# EasyEDA Pro project rp2350B（maybe support bf25.12）（only sch）.epro

# Schematic Schematic1

## Sheets
1 RP2350B: Board Name: Board1; Create Date: 2025-10-30; Page Name: RP2350B; Project Name: 飞控; Schematic Name: Schematic1; Update Date: 2025-11-05; Company: 嘉立创EDA; Page Size: A4; Version: V1.0
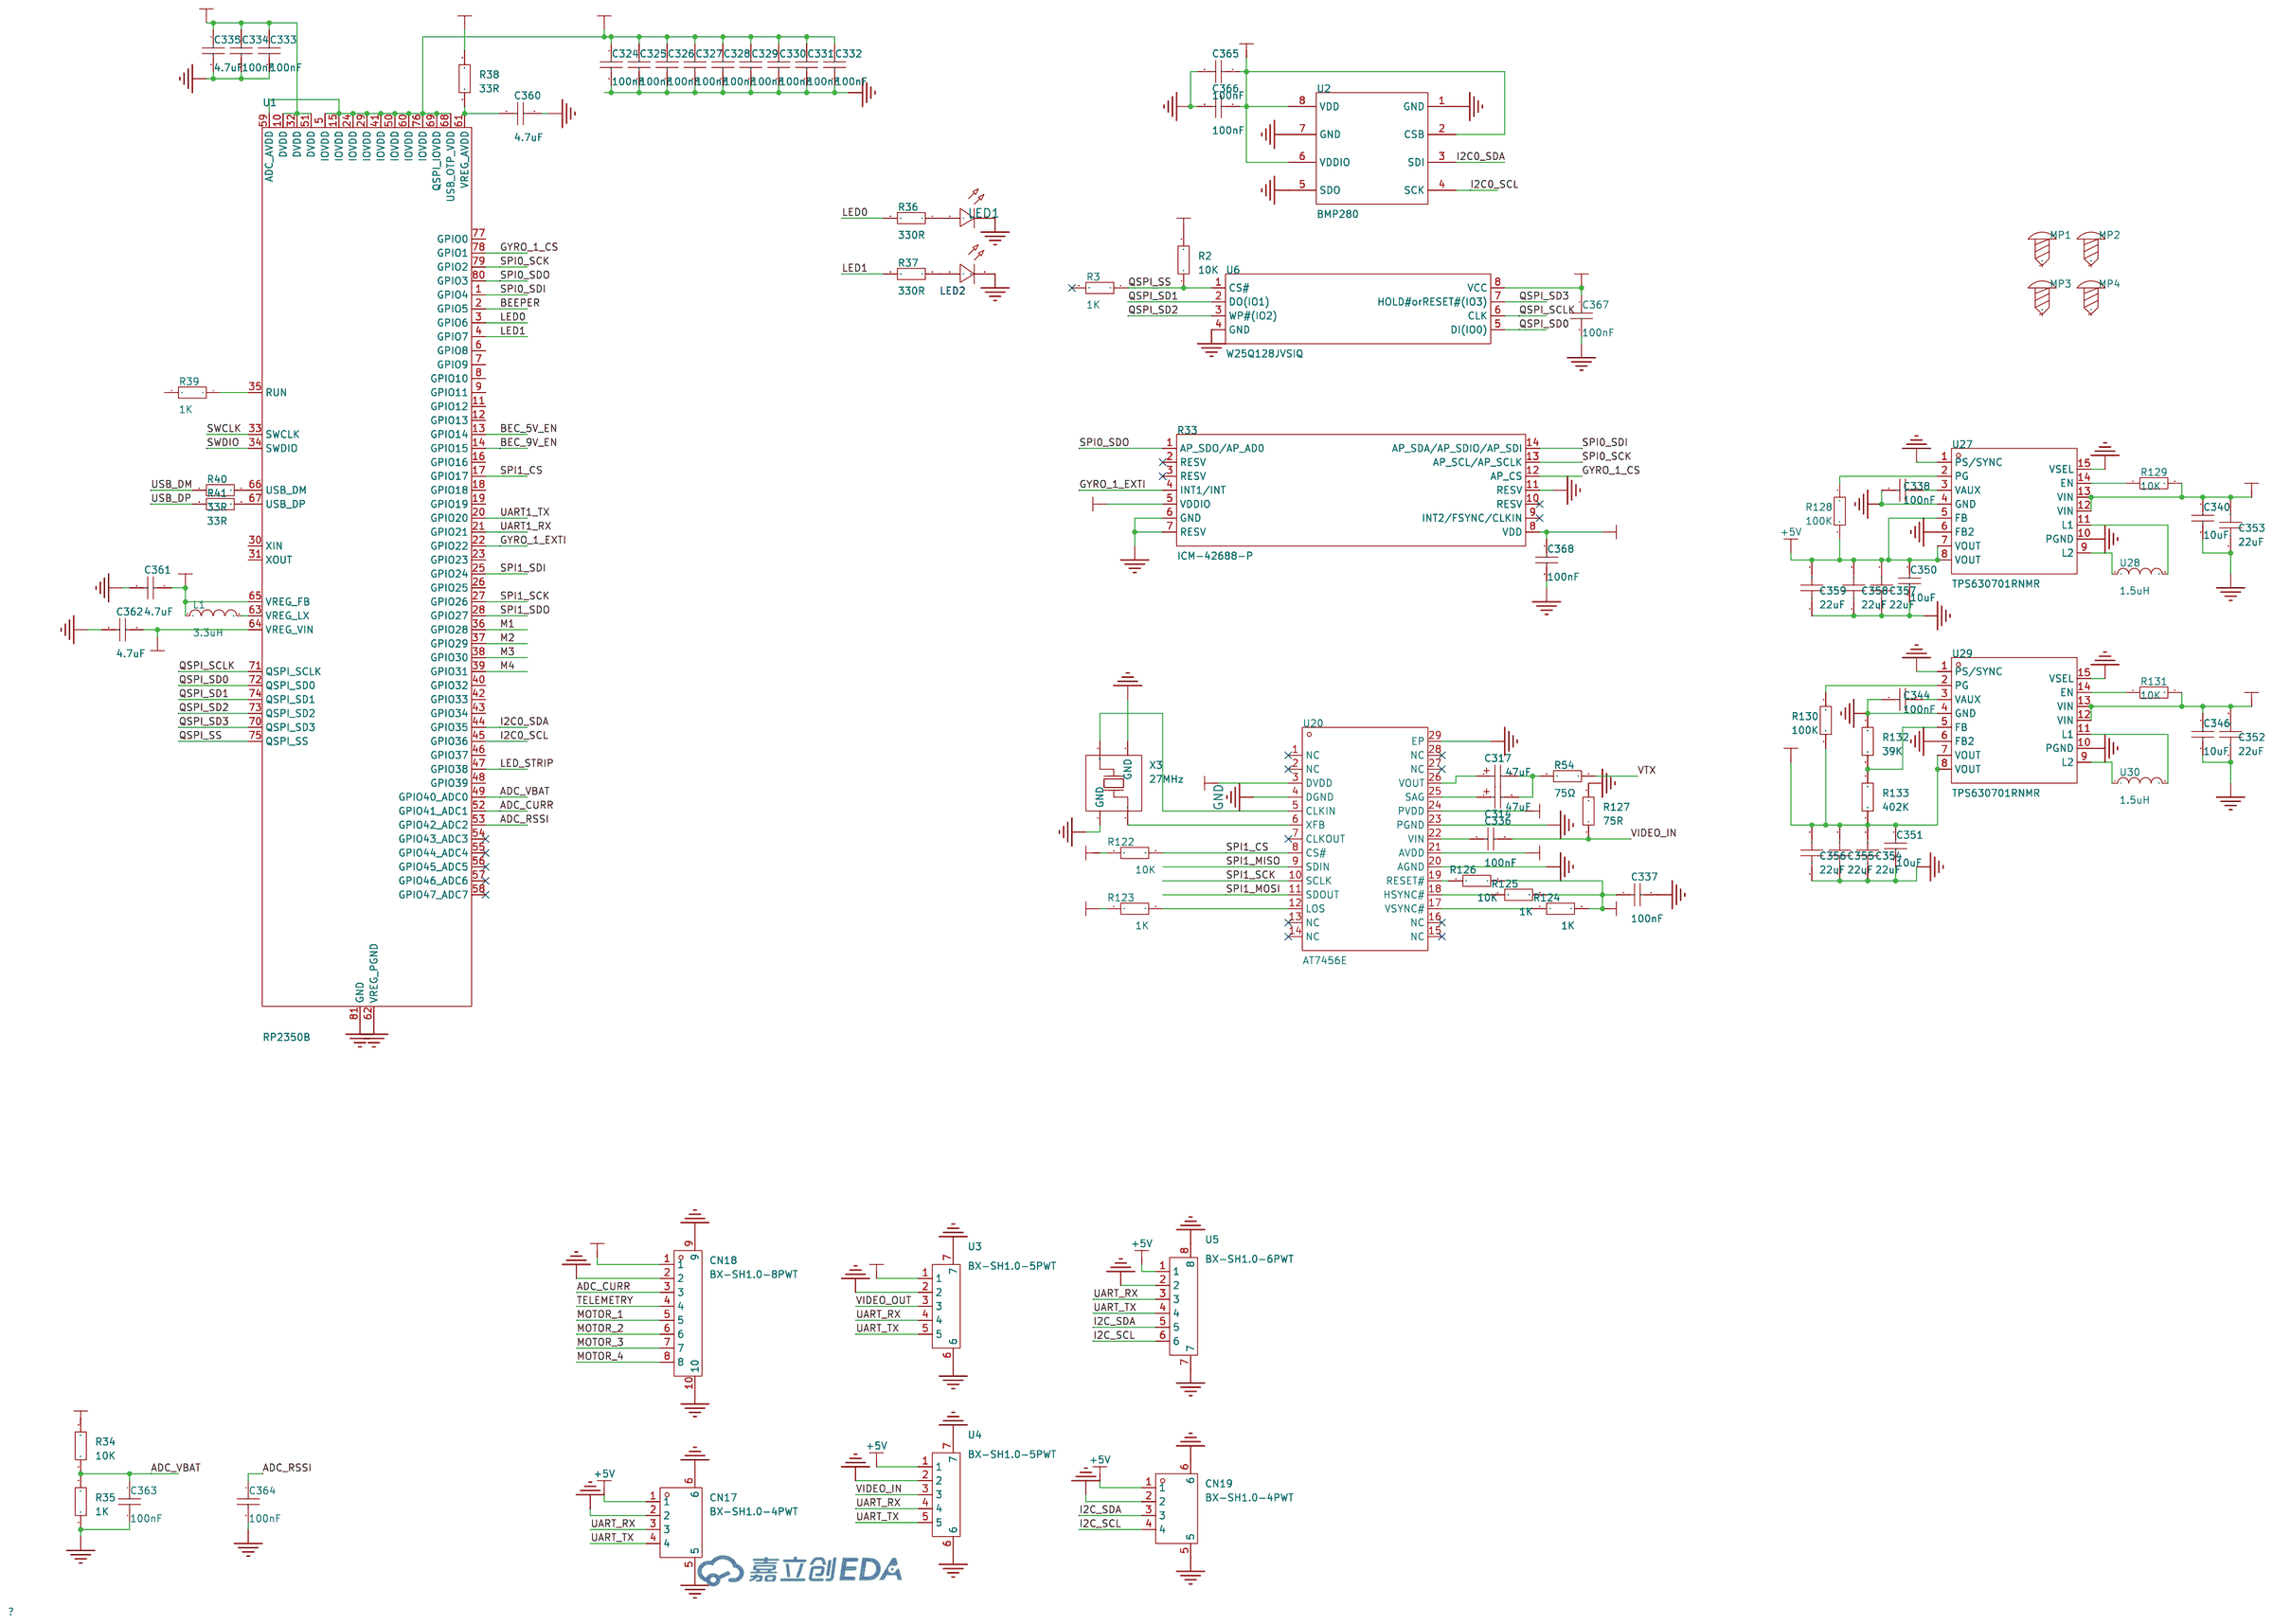
[diagram p0: RP2350B]
2 ELRS: Create Date: 2025-11-03; Page Name: ELRS; Update Date: 2025-11-03
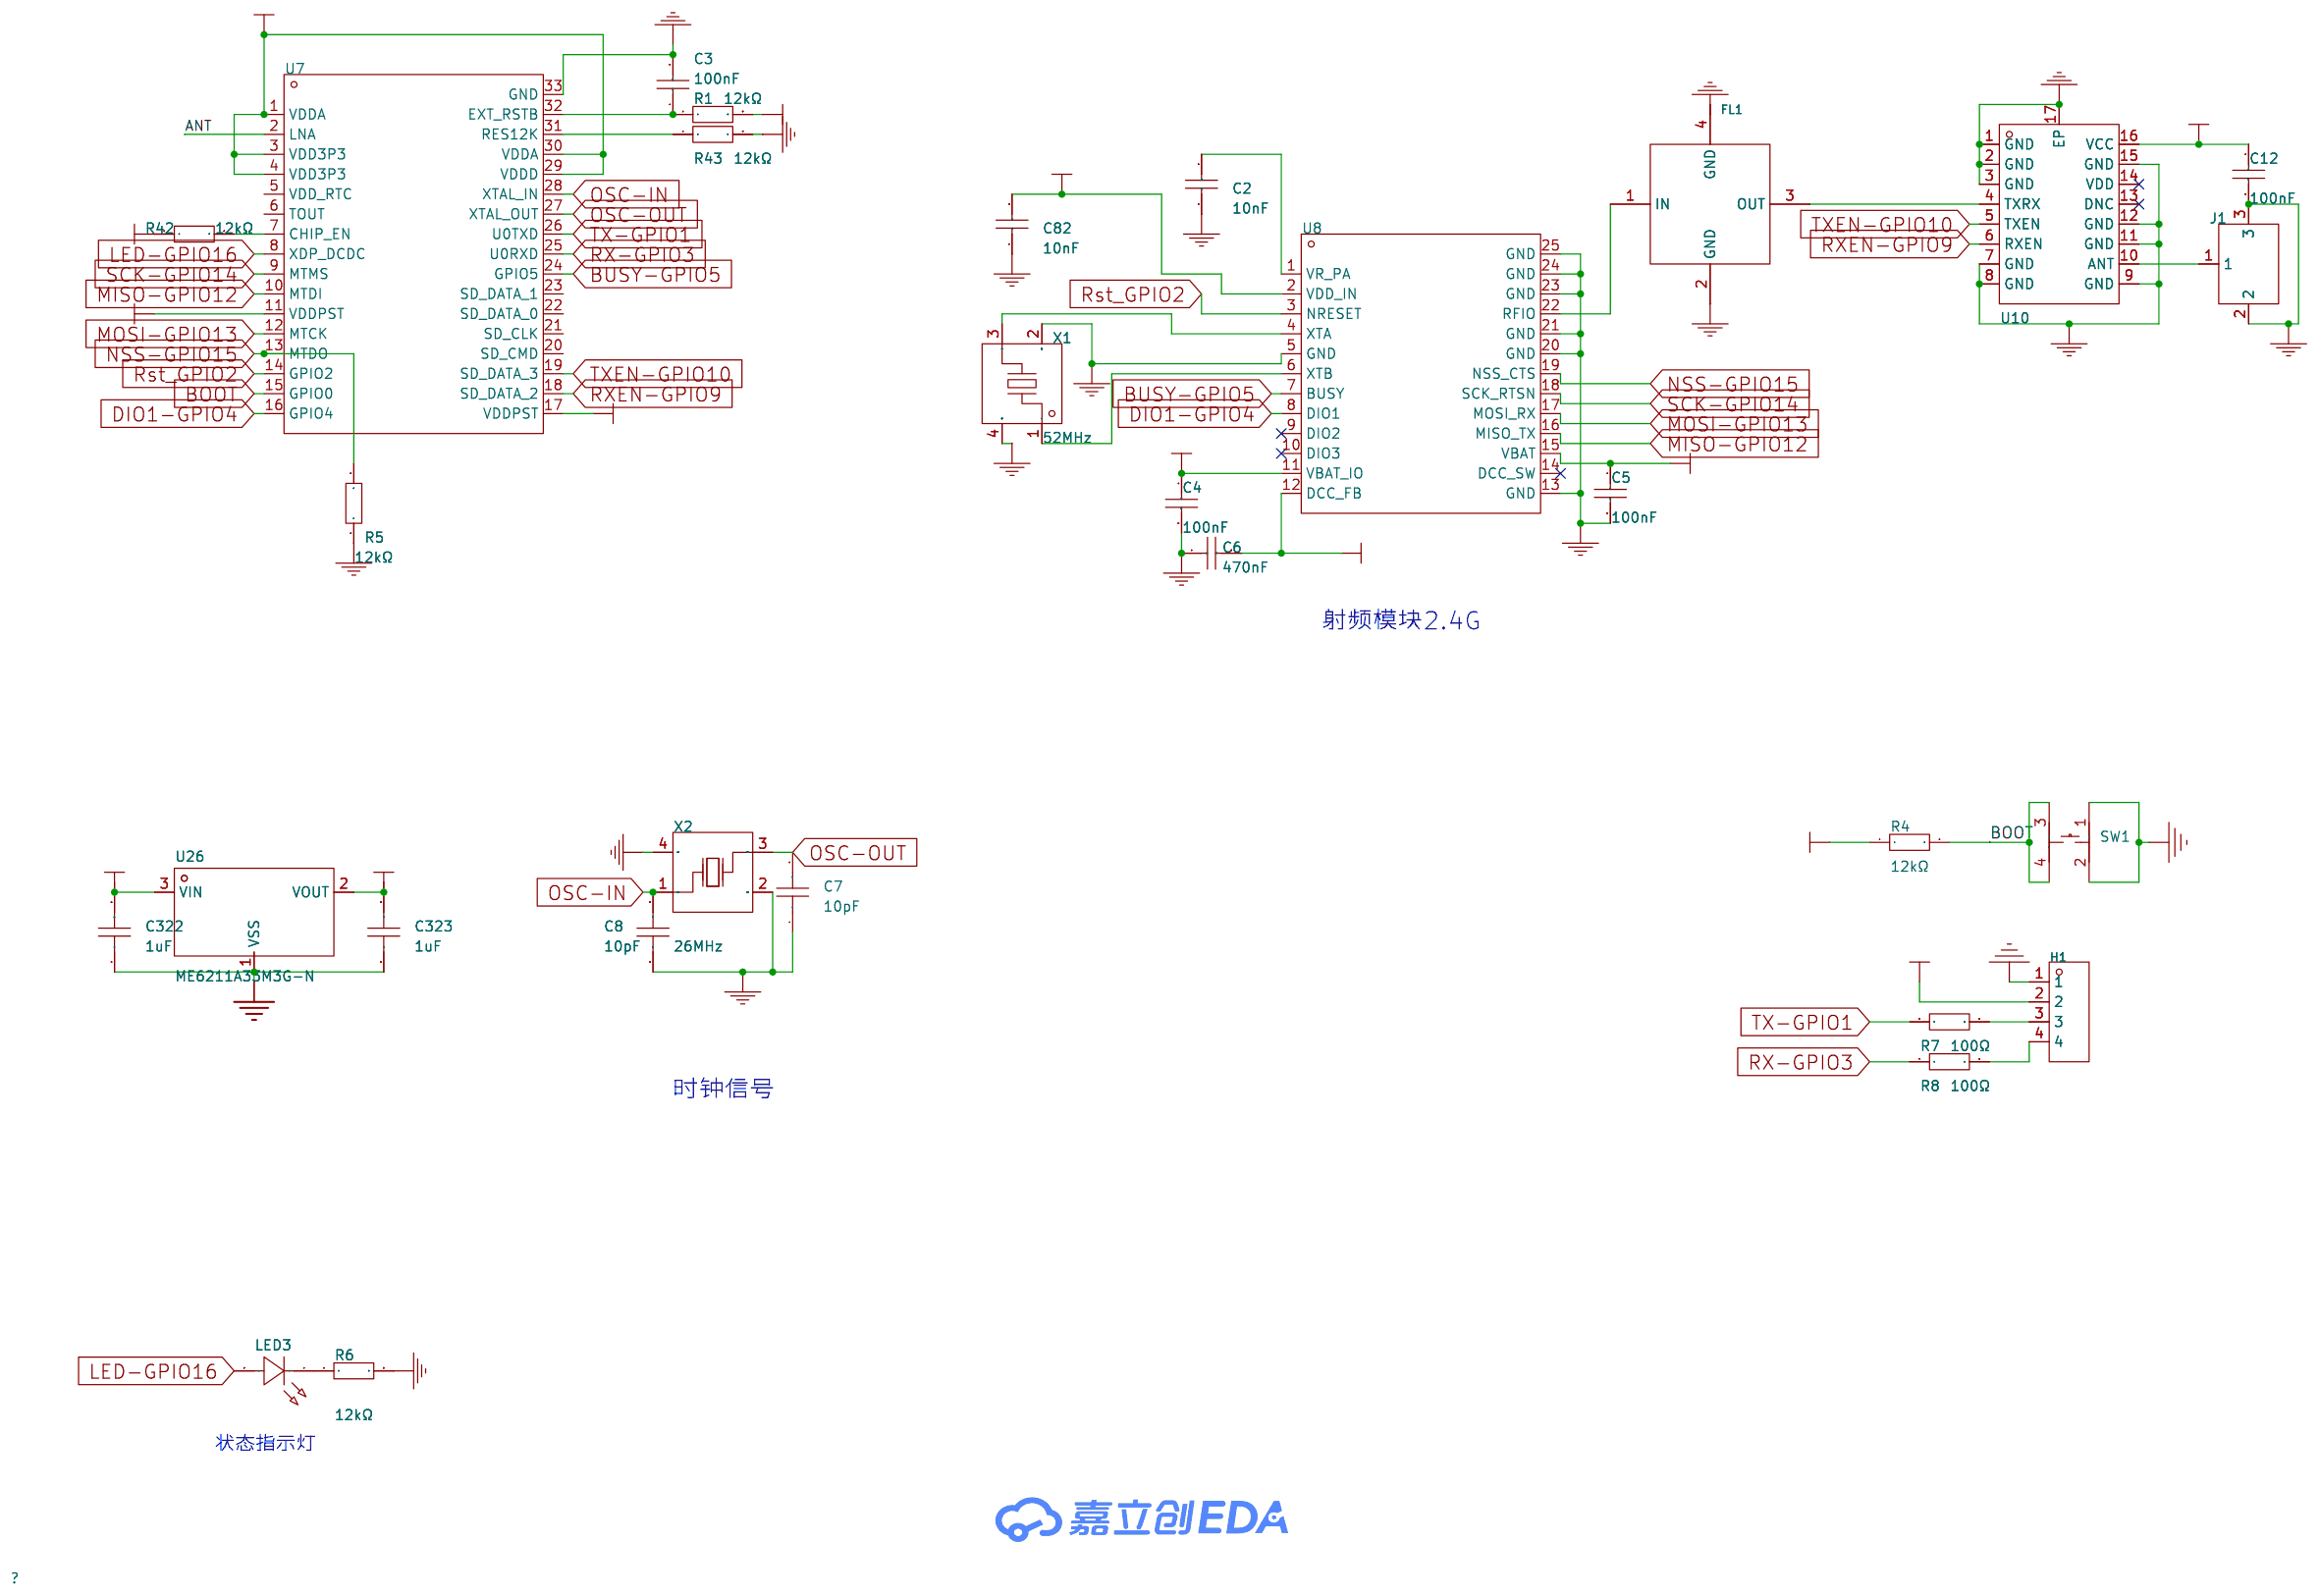
[diagram p1: ELRS]
3 MOTOR: Create Date: 2025-11-03; Page Name: MOTOR; Update Date: 2025-11-03
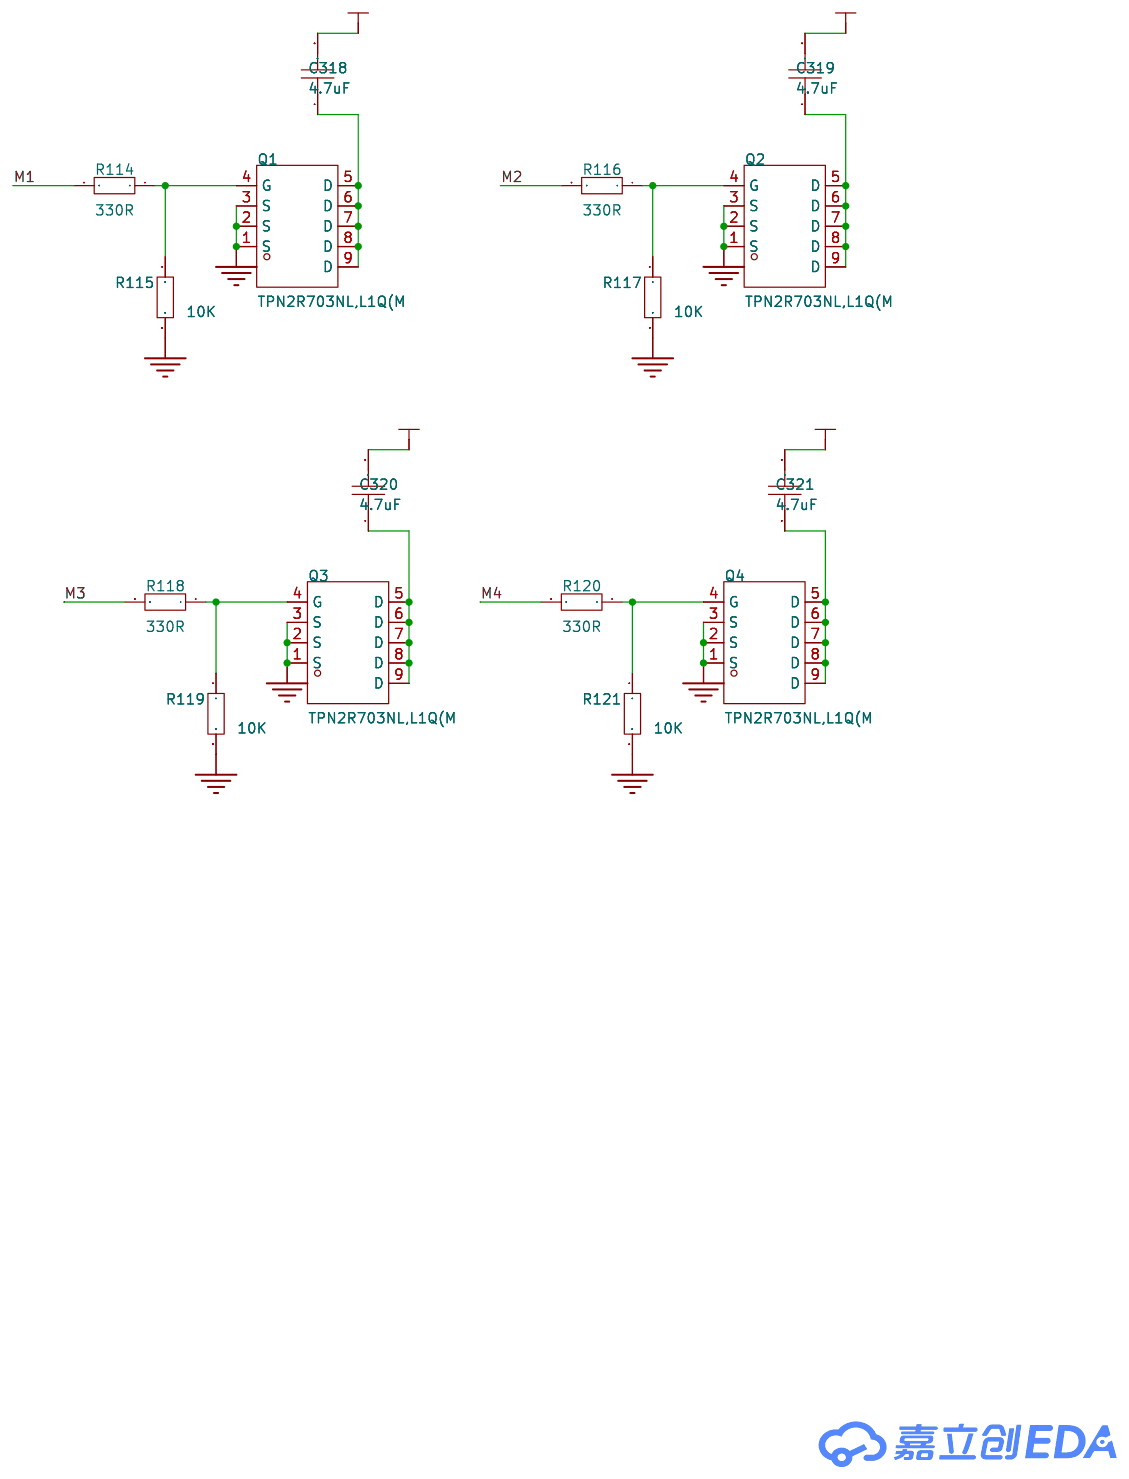
[diagram p2: MOTOR]

## Parts
sheet ELRS
C2  10nF  [C0402]
C3  100nF  [C0402]
C4  100nF  [C0402]
C5  100nF  [C0402]
C6  470nF  [C0402]
C7  10pF  [C0402]
C8  10pF  [C0402]
C12  100nF  [C0402]
C82  10nF  [C0402]
C322  1uF  [C0402]
C323  1uF  [C0402]
FL1  2450FM07D0034T  [FILTER-SMD_4P-L1.0-W0.5-L]
H1  PZ254V-11-04P  [HDR-TH_4P-P2.54-V-M]
J1  BWU.FL-IPEX1  [IPEX-SMD_BWIPX-1-001E]
LED3  XL-1005UGC  [0402]
R1  12kΩ  [0402]
R4  12kΩ  [0402]
R5  12kΩ  [0402]
R6  12kΩ  [0402]
R7  100Ω  [0402]
R8  100Ω  [0402]
R42  12kΩ  [0402]
R43  12kΩ  [0402]
SW1  TS-1928-B  [KEY-SMD_4P-L2.8-W2.0-P1.20-LS3.0-TL]
U7  ESP8285H16  [QFN-32_L5.0-W5.0-P0.50-TL-EP3.7]
U8  SX1280IMLTRT  [QFN-24_L4.0-W4.0-P0.50-BL-EP2.6]
U10  AT2401C  [QFN-16_L3.0-W3.0-P0.50-BL-EP1.7]
U26  ME6211A33M3G-N  [SOT-23-3_L2.9-W1.6-P1.90-LS2.8-BR]
X1  52MHz  [CRYSTAL-SMD_4P-L2.0-W1.6-BL]
X2  26MHz  [CRYSTAL-SMD_4P-L2.0-W1.6-BL]
sheet MOTOR
C318  4.7uF  [C0603]
C319  4.7uF  [C0603]
C320  4.7uF  [C0603]
C321  4.7uF  [C0603]
Q1  TPN2R703NL,L1Q(M  [TSON-8_L3.1-W3.1-P0.65-LS3.3-BL-EP]
Q2  TPN2R703NL,L1Q(M  [TSON-8_L3.1-W3.1-P0.65-LS3.3-BL-EP]
Q3  TPN2R703NL,L1Q(M  [TSON-8_L3.1-W3.1-P0.65-LS3.3-BL-EP]
Q4  TPN2R703NL,L1Q(M  [TSON-8_L3.1-W3.1-P0.65-LS3.3-BL-EP]
R114  330R  [R0402]
R115  10K  [R0402]
R116  330R  [R0402]
R117  10K  [R0402]
R118  330R  [R0402]
R119  10K  [R0402]
R120  330R  [R0402]
R121  10K  [R0402]
sheet RP2350B
C314  47uF  [CAP-SMD_L3.2-W1.6-RD]
C317  47uF  [CAP-SMD_L3.2-W1.6-RD]
C324  100nF  [C0402]
C325  100nF  [C0402]
C326  100nF  [C0402]
C327  100nF  [C0402]
C328  100nF  [C0402]
C329  100nF  [C0402]
C330  100nF  [C0402]
C331  100nF  [C0402]
C332  100nF  [C0402]
C333  100nF  [C0402]
C334  100nF  [C0402]
C335  4.7uF  [C0402]
C336  100nF  [C0402]
C337  100nF  [C0402]
C338  100nF  [C0402]
C340  10uF  [C0402]
C344  100nF  [C0402]
C346  10uF  [C0402]
C350  10uF  [C0402]
C351  10uF  [C0402]
C352  22uF  [C0805]
C353  22uF  [C0805]
C354  22uF  [C0805]
C355  22uF  [C0805]
C356  22uF  [C0805]
C357  22uF  [C0805]
C358  22uF  [C0805]
C359  22uF  [C0805]
C360  4.7uF  [C0402]
C361  4.7uF  [C0402]
C362  4.7uF  [C0402]
C363  100nF  [C0402]
C364  100nF  [C0402]
C365  100nF  [C0402]
C366  100nF  [C0402]
C367  100nF  [C0402]
C368  100nF  [C0402]
CN17  BX-SH1.0-4PWT  [CONN-SMD_4P-P1.00_BX-SH1.0-4PWT]
CN18  BX-SH1.0-8PWT  [CONN-SMD_8P-P1.00_BX-SH1.0-8PWT]
CN19  BX-SH1.0-4PWT  [CONN-SMD_4P-P1.00_BX-SH1.0-4PWT]
L1  3.3uH  [L0402]
LED1  -  [LED_0402]
LED2  -  [LED_0402]
MP1  M2螺丝  [M2螺丝]
MP2  M2螺丝  [M2螺丝]
MP3  M2螺丝  [M2螺丝]
MP4  M2螺丝  [M2螺丝]
R2  10K  [R0402]
R3  1K  [R0402]
R33  ICM-42688-P  [LGA-14_L3.0-W2.5-P0.50-TL]
R34  10K  [R0402]
R35  1K  [R0402]
R36  330R  [R0402]
R37  330R  [R0402]
R38  33R  [R0402]
R39  1K  [R0402]
R40  33R  [R0402]
R41  33R  [R0402]
R54  75Ω  [R0402]
R122  10K  [0402]
R123  1K  [0402]
R124  1K  [0402]
R125  1K  [0402]
R126  10K  [0402]
R127  75R  [0402]
R128  100K  [R0402]
R129  10K  [R0402]
R130  100K  [R0402]
R131  10K  [R0402]
R132  39K  [R0402]
R133  402K  [R0402]
U1  RP2350B  [QFN-80_L10.0-W10.0-P0.40-TL-EP3.4]
U2  BMP280  [LGA-8_L2.5-W2.0-P0.65_AMP6127]
U3  BX-SH1.0-5PWT  [CONN-SMD_5P-P1.00_BX-SH1.0-5PWT]
U4  BX-SH1.0-5PWT  [CONN-SMD_5P-P1.00_BX-SH1.0-5PWT]
U5  BX-SH1.0-6PWT  [CONN-SMD_6P-P1.00_BX-SH1.0-6PWT]
U6  W25Q128JVSIQ  [SOIC-8_L5.3-W5.3-P1.27-LS8.0-BL]
U20  AT7456E  [TSSOP-28_L9.7-W4.4-P0.65-LS6.4-BL-EP-2]
U27  TPS630701RNMR  [VQFN-HR-15_L3.0-W2.5-P0.50-BL_TPS63070RNMR]
U28  1.5uH  [IND-SMD_L2.5-W2.0_MEKK2520TR47M]
U29  TPS630701RNMR  [VQFN-HR-15_L3.0-W2.5-P0.50-BL_TPS63070RNMR]
U30  1.5uH  [IND-SMD_L2.5-W2.0_MEKK2520TR47M]
X3  27MHz  [OSC-SMD_4P-L3.2-W2.5-BL]

## Library data of the parts
C2 C82 = CL05B103KB5NNNC: 容值:10nF;精度:±10%;额定电压:50V;材质(温度系数):X7R;; LCSC Part Name: 10nF ±10% 50V; Supplier Part: C15195; Manufacturer: SAMSUNG(三星); Supplier Footprint: 0402; JLCPCB Part Class: Basic Part; Datasheet: https://atta.szlcsc.com/upload/public/pdf/source/20160103/1457707674468.pdf; Supplier: LCSC; Tolerance: ±10%; Voltage Rated: 50V; Temperature Coefficient: X7R
C3-C5 C12 C324-C338 C340 C344 C346 C350 C351 C360-C368 = CL05B104KO5NNNC: 容值:100nF;精度:±10%;额定电压:16V;材质(温度系数):X7R;; LCSC Part Name: 100nF ±10% 16V; Supplier Part: C1525; Manufacturer: SAMSUNG(三星); Supplier Footprint: 0402; JLCPCB Part Class: 基础库; Datasheet: https://atta.szlcsc.com/upload/public/pdf/source/20160103/1457707674891.pdf; Supplier: LCSC; Tolerance: ±10%; Voltage Rated: 16V; Temperature Coefficient: X7R
C6 = CL05A474KP5NNNC: 容值:470nF;精度:±10%;额定电压:10V;材质(温度系数):X5R;; LCSC Part Name: 470nF ±10% 10V; Supplier Part: C47339; Manufacturer: SAMSUNG(三星); Supplier Footprint: 0402; JLCPCB Part Class: 基础库; Datasheet: https://atta.szlcsc.com/upload/public/pdf/source/20160103/1457707728896.pdf; Supplier: LCSC; Tolerance: ±10%; Voltage Rated: 10V; Temperature Coefficient: X5R
C7 C8 C322 C323 = CL05C100JB5NNNC: 容值:10pF;精度:±5%;额定电压:50V;材质(温度系数):C0G;; LCSC Part Name: 10pF ±5% 50V; Supplier Part: C32949; Manufacturer: SAMSUNG(三星); Supplier Footprint: 0402; JLCPCB Part Class: 基础库; Datasheet: https://atta.szlcsc.com/upload/public/pdf/source/20160103/1457707722238.pdf; Supplier: LCSC; Tolerance: ±5%; Voltage Rated: 50V; Temperature Coefficient: C0G
FL1 = 2450FM07D0034T: 带宽:100MHz;插入损耗:0.75dB;; Supplier Part: C2651081; Manufacturer: JOHANSON(约翰逊); Supplier Footprint: SMD-4P,0.5x1mm; JLCPCB Part Class: 扩展库; Datasheet: https://atta.szlcsc.com/upload/public/pdf/source/20210612/9CA01AE84E996BD7C4301146C7410C29.pdf; Supplier: LCSC; Bandwidth: 100MHz; Insertion Loss: 0.75dB
H1 = PZ254V-11-04P: 排数:单排;总PIN位数:4P;间距:2.54mm;插针结构:1x4P;行距:-;安装类型:直插;圆针/方针:方针;额定电流:3A;额定电压:250V;配合针长度:6mm;塑高:2.5mm;端接针长度:3mm;触头材质:-;工作温度范围:-40℃~+105℃;颜色:黑色;; LCSC Part Name: 2.54mm 1x4P 直插 方针; Supplier Part: C2691448; Manufacturer: XFCN(兴飞); Supplier Footprint: 插件,P=2.54mm; JLCPCB Part Class: 扩展库; Datasheet: https://atta.szlcsc.com/upload/public/pdf/source/20200309/C492403_F9F19131791D08044AD4F84F8E751A34.pdf; Supplier: LCSC; Number of Rows: 单排; Number of Pins: 4P; Pitch: 2.54mm; Pin Structure: 1x4P; Mounting Type: 直插; Circluar Pins/Square Pins: 方针; Current Rating (Max): 3A; Voltage Rating (Max): 250V; Length of Mating Pin: 6mm; Insulation Height: 2.5mm; Length of End Connection Pin: 3mm; Operating Temperature Range: -40℃~+105℃; Color: 黑色
J1 = BWU.FL-IPEX1: 连接器类型:板端;接口类型:内针;频率-最大值:6GHz;接口直径:2mm;射频系列:IPEX;端口数量:1;阻抗:50Ω;接口长度/高度:1.25mm;工作温度范围:260℃;; LCSC Part Name: IPEX 内针; Supplier Part: C5137195; Manufacturer: BAT WIRELESS(蝙蝠无线); Supplier Footprint: SMD; JLCPCB Part Class: 扩展库; Datasheet: https://atta.szlcsc.com/upload/public/pdf/source/20220815/058ABE525AAE400925F1A3839AB872AC.pdf; Supplier: LCSC; Connector Type: 板端; Interface Type: 内针; Frequency-Max: 6GHz; Interface Diameter: 2mm; RF Series: IPEX; Number of Ports: 1; Impedance: 50Ω; Interface Length/Height: 1.25mm; Operating Temperature Range: 260℃
LED3 = XL-1005UGC: 发光颜色:翠绿;主波长:516nm;色温:-;功率:80mW;安装方式:正贴;; LCSC Part Name: 正贴; Supplier Part: C2856703; Manufacturer: XINGLIGHT(成兴光); JLCPCB Part Class: 扩展库; Datasheet: https://atta.szlcsc.com/upload/public/pdf/source/20221102/FF8D6BC2225363A60A01D46BB802F217.pdf; Supplier: LCSC; Emitted Color: 翠绿; Lens Color: 无色透明; Dominant Wavelength: 516nm; Peak Wavelength: 531nm; Forward Current: 25mA; Power Dissipation: 80mW; Viewing Angle: 120°; Mounting Sytle: 正贴; Operating Temperature: -30℃~+85℃
R1 R4-R6 R42 R43 = 0402WGF1202TCE: 电阻类型:厚膜电阻;阻值:12kΩ;精度:±1%;功率:62.5mW;; LCSC Part Name: 12kΩ ±1% 62.5mW; Supplier Part: C25752; Manufacturer: UNI-ROYAL(厚声); JLCPCB Part Class: 基础库; Datasheet: https://atta.szlcsc.com/upload/public/pdf/source/20200306/C422600_1E6D84923E4A46A82E41ADD87F860B5C.pdf; Supplier: LCSC; Type: 厚膜电阻; Tolerance: ±1%; Power(Watts): 62.5mW; Temperature Coefficient: ±100ppm/℃; Overload Voltage (Max): 50V; Operating Temperature Range: -55℃~+155℃
R7 R8 R122-R127 = 0402WGF1000TCE: 阻值:100Ω;精度:±1%;功率:62.5mW;温度系数:±200ppm/℃;电阻类型:厚膜电阻;; LCSC Part Name: 100Ω ±1% 62.5mW 厚膜电阻; Supplier Part: C25076; Manufacturer: UNI-ROYAL(厚声); JLCPCB Part Class: 基础库; Datasheet: https://atta.szlcsc.com/upload/public/pdf/source/20200306/C422600_1E6D84923E4A46A82E41ADD87F860B5C.pdf; Supplier: LCSC; Tolerance: ±1%; Power(Watts): 62.5mW; Overload Voltage (Max): 50V; Temperature Coefficient: ±200ppm/℃; Type: 厚膜电阻; Operating Temperature Range: -55℃~+155℃
SW1 = TS-1928-B: 触点电流:50mA;额定电压(DC):12V;绝缘电阻:-;电路结构:单刀单掷;安装方式:立贴;带灯:无;作用力:160gf;机械寿命:30万次;带支架:否;; LCSC Part Name: 立贴 1.95*2.8*0.6mm 轻触开关; Supplier Part: C1121891; Manufacturer: XKB Connectivity(中国星坤); Supplier Footprint: SMD; JLCPCB Part Class: 扩展库; Datasheet: https://atta.szlcsc.com/upload/public/pdf/source/20211011/D4E0D57631292A8298BD84F341C06C74.pdf; Supplier: LCSC; Contact Current: 50mA; Voltage Rating (DC): 12V; Circuit: 单刀单掷; Mounting Style: 立贴; Actuator Style: 圆形按钮; Actuator/Cap Color: 黑色; With Lamp: 无; Operating Force: 160gf; Mechanical Life: 30万次; Operating Temperature: -30℃~+85℃; Switch Length: 1.95mm; Switch Width: 2.8mm; Switch Height: 0.6mm; Strike Gundam: 否
U7 = ESP8285H16: 接口类型:-;; Supplier Part: C967019; Manufacturer: ESPRESSIF(乐鑫); Supplier Footprint: QFN-32; JLCPCB Part Class: 扩展库; Datasheet: https://atta.szlcsc.com/upload/public/pdf/source/20201208/C967018_16BE38E2B139B5CC4A4A2601BD6D347C.pdf; Supplier: LCSC
U8 = SX1280IMLTRT: Supplier Part: C125969; Manufacturer: SEMTECH; Supplier Footprint: QFN-24-EP(4x4); JLCPCB Part Class: 扩展库; Datasheet: https://atta.szlcsc.com/upload/public/pdf/source/20180620/C125969_B671A7544015FF474F30CCF0F8154652.PDF; Supplier: LCSC
U10 = AT2401C: Supplier Part: C783588; Manufacturer: 杭州中科微; Supplier Footprint: QFN; JLCPCB Part Class: 扩展库; Datasheet: https://atta.szlcsc.com/upload/public/pdf/source/20210918/B63766BE646BC5750E173F3CF585A1F8.pdf; Supplier: LCSC
U26 = ME6211A33M3G-N: 输出类型:固定;工作电压:6V;输出电压:3.3V;输出电流:500mA;电源纹波抑制比(PSRR):70dB@(1kHz);输出极性:正极;; LCSC Part Name: 输入6V 输出3.3V 500mA; Supplier Part: C168807; Manufacturer: MICRONE(南京微盟); Supplier Footprint: SOT-23-3; JLCPCB Part Class: 扩展库; Datasheet: https://atta.szlcsc.com/upload/public/pdf/source/20180224/C168807_15194366627921363679.pdf; Supplier: LCSC; Output Type: 固定; Voltage - Supply: 6V; Output Voltage: 3.3V; Output Current: 500mA; Power Supply Rejection Ratio (PSRR): 70dB@(1kHz); Voltage Dropout: 120mV@(100mA); standby current: 60uA; Noise: 50uVrms; Features: 过流保护；带使能；短路保护; Operating Temperature: -40℃~+150℃; Output Configuration: 正极; Number of Outputs: 1
X1 = 7D052000K01: 频率:52MHz;频率公差:±10ppm;负载电容:11pF;; LCSC Part Name: 52MHz ±10ppm 11pF; Supplier Part: C781784; Manufacturer: HD(浩都频率); Supplier Footprint: SMD2016-4P; JLCPCB Part Class: 扩展库; Datasheet: https://atta.szlcsc.com/upload/public/pdf/source/20220223/F1A4CFB1E963BF2DCD368CB38C2B78AF.pdf; Supplier: LCSC; Crystal Type: 贴片无源晶振; Frequency Tolerance: ±10ppm; Frequency Stability: ±20ppm; Load Capacitance: 11pF
X2 = S2126000121080: 频率:26MHz;频率公差:±10ppm;负载电容:12pF;; LCSC Part Name: 26MHz ±10ppm 内置负载电容:12pF; Supplier Part: C390789; Manufacturer: JGHC(晶光华); Supplier Footprint: SMD2016-4P; JLCPCB Part Class: 扩展库; Datasheet: https://atta.szlcsc.com/upload/public/pdf/source/20191012/C390789_EEB0CA5BA4936358B143D734CA2B8FF9.pdf; Supplier: LCSC; Crystal Type: 贴片无源晶振; Frequency Tolerance: ±10ppm; Load Capacitance: 12pF; Equivalent Series Resistance (ESR): 80Ω; Operating Temperature: -40℃~+85℃
C318-C321 = CAP_0603: Supplier Footprint: 0603
Q1-Q4 = TPN2R703NL,L1Q(M: 类型:1个N沟道;漏源电压(Vdss):30V;连续漏极电流(Id):-;导通电阻(RDS(on)@Vgs,Id):3.3mΩ@4.5V,22.5A;功率:42W;阈值电压(Vgs(th)@Id):1.3V@0.3mA;; Supplier Part: C5307666; Manufacturer: TOSHIBA(东芝); Supplier Footprint: TSON-8; JLCPCB Part Class: 扩展库; Datasheet: https://atta.szlcsc.com/upload/public/pdf/source/20221207/F3F28B90115C5E074AC0CD2ED28456D7.pdf; Supplier: LCSC; Type: 1个N沟道; Drain Source Voltage (Vdss): 30V; Drain Source On Resistance (RDS(on)@Vgs,Id): 3.3mΩ@4.5V,22.5A; Power Dissipation (Pd): 42W; Gate Threshold Voltage (Vgs(th)@Id): 1.3V@0.3mA; Input Capacitance (Ciss@Vds): 1.6nF@15V; Reverse Transfer Capacitance (Crss@Vds): 53pF@15V
R2 R3 R34-R41 R114-R121 R128-R133 = Res_0402: Supplier Footprint: 0402
C314 C317 = TC212A476K006Y: 容值:47uF;精度:±10%;额定电压:6.3V;等效串联电阻:2.5Ω@100kHz;; LCSC Part Name: 47uF ±10% 6.3V; Supplier Part: C108525; Manufacturer: Sunlord(顺络); Supplier Footprint: CASE-A-3216-18(mm); JLCPCB Part Class: Extended Part; Datasheet: https://atta.szlcsc.com/upload/public/pdf/source/20231030/DDA5D10C6B7FCAF98AC7C23C2BD0B0CB.pdf; Supplier: LCSC; Tolerance: ±10%; Rated Voltage: 6.3V; Equivalent Series Resistance(ESR): 2.5Ω@100kHz; Operating Temperature: -55℃~+125℃; Voltage Rated: 6.3V; Temperature Coefficient: X5R
C352-C359 = CAP_0805: Supplier Footprint: 0805
CN17 CN19 = BX-SH1.0-4PWT: 插针结构:1x4P;间距:1mm;安装方式:卧贴;参考系列:SH;总PIN数:4P;排数:1;每排PIN数:4;行距:-;额定电流:1A;触头材质:黄铜;触头镀层:锡;工作温度范围:-25℃~+85℃;; Supplier Part: C18077910; Manufacturer: Bossie(博锡); Supplier Footprint: SMD,P=1mm,卧贴; JLCPCB Part Class: 扩展库; Datasheet: https://atta.szlcsc.com/upload/public/pdf/source/20231017/8441177999D7CFAB362C86942B43304B.pdf; Supplier: LCSC; Pins Structure: 1x4P; Pitch: 1mm; Mounting Style: 卧贴; Reference Series: SH; Number of Pins: 4P; Number of Rows: 1; Number of PINs Per Row: 4; Current Rating (Max): 1A; Contact Material: 黄铜; Contact Plating: 锡; Operating Temperature Range: -25℃~+85℃; Gender: 公型插针
CN18 = BX-SH1.0-8PWT: 插针结构:1x8P;间距:1mm;安装方式:卧贴;参考系列:SH;总PIN数:8P;排数:1;每排PIN数:8;行距:-;额定电流:1A;触头材质:黄铜;触头镀层:锡;工作温度范围:-25℃~+85℃;; Supplier Part: C18077914; Manufacturer: Bossie(博锡); Supplier Footprint: SMD,P=1mm,卧贴; JLCPCB Part Class: 扩展库; Datasheet: https://atta.szlcsc.com/upload/public/pdf/source/20231017/8E39787C5B6663B55FC7D16812F6212A.pdf; Supplier: LCSC; Pins Structure: 1x8P; Pitch: 1mm; Mounting Style: 卧贴; Reference Series: SH; Number of Pins: 8P; Number of Rows: 1; Number of PINs Per Row: 8; Current Rating (Max): 1A; Contact Material: 黄铜; Contact Plating: 锡; Operating Temperature Range: -25℃~+85℃; Gender: 公
L1 = L_0402
LED1 = LED_0402-R: Supplier Footprint: 0402
LED2 = LED_0402-G: Supplier Footprint: 0402
MP1-MP4 = 螺丝孔
R33 = ICM-42688-P: LCSC Part Name: ICM 42688 P; Supplier Part: C1850418; Manufacturer: TDK InvenSense(应美盛); Supplier Footprint: LGA-14(2.5x3); JLCPCB Part Class: 扩展库; Datasheet: https://atta.szlcsc.com/upload/public/pdf/source/20210703/CF24204867ACE5B754A2B035F23E5931.pdf; Supplier: LCSC
R54 = WR04X75R0FTL: 阻值:75Ω;精度:±1%;功率:62.5mW;温度系数:±100ppm/℃;最大工作电压:50V;工作温度范围:-55℃~+155℃;; LCSC Part Name: 75Ω ±1% 62.5mW; Supplier Part: C168249; Manufacturer: Walsin(华新科); Supplier Footprint: 0402; JLCPCB Part Class: Extended Part; Supplier: LCSC; Tolerance: ±1%; Power(Watts): 62.5mW; Temperature Coefficient: ±100ppm/℃; Overload Voltage (Max): 50V; Operating Temperature Range: -55℃~+155℃
U1 = RP2350B_C42415655: 推荐配套ABRACON  C42411119使用  升级版本：A4; LCSC Part Name: 微控制器; Supplier Part: C42415655; Manufacturer: Raspberry Pi(树莓派); Supplier Footprint: QFN-80-EP(10x10); JLCPCB Part Class: 扩展库; Datasheet: https://item.szlcsc.com/datasheet/RP2350B/44413055.html; Supplier: LCSC
U2 = BMP280: Bosch气压传感器新品，可测量大气压力，带高精度温度测量，可校准精确计算海拔高度。I2C或SPI接口，宽量程（300-1100hpa），精度高; LCSC Part Name: BMP280 停产; Supplier Part: C83291; Manufacturer: Bosch(博世); Supplier Footprint: LGA-8(2x2.5); JLCPCB Part Class: 扩展库; Datasheet: https://atta.szlcsc.com/upload/public/pdf/source/20200702/C83291_F39E84AB7DFC569A4C7554F8659640A1.pdf; Supplier: LCSC
U3 U4 = BX-SH1.0-5PWT: 插针结构:1x5P;间距:1mm;安装方式:卧贴;参考系列:SH;总PIN数:5P;排数:1;每排PIN数:5;行距:-;额定电流:1A;触头材质:黄铜;触头镀层:锡;工作温度:-;; LCSC Part Name: 1x5P 间距:1mm 卧贴 系列:SH; Supplier Part: C18077911; Manufacturer: Bossie(博锡); Supplier Footprint: SMD,P=1mm,卧贴; JLCPCB Part Class: 扩展库; Datasheet: https://item.szlcsc.com/datasheet/BX-SH1.0-5PWT/19218312.html; Supplier: LCSC; Pins Structure: 1x5P; Pitch: 1mm; Mounting Type: 卧贴; Reference Series: SH; Number of Pins: 5P; Number of Rows: 1; Number of PINs Per Row: 5; Current Rating: 1A; Contact Material: 黄铜; Contact Plating: 锡; Supplementary Features: 辅助焊脚; Color: 米色; Z-Height of the Board: 3.15mm; X-Length of Bottom Edge on Board (Spacing Line): 7.35mm; Y-Width of Bottom Edge on Board: 5.05mm
U5 = BX-SH1.0-6PWT: 插针结构:1x6P;间距:1mm;安装方式:卧贴;参考系列:SH;总PIN数:6P;排数:1;每排PIN数:6;行距:-;额定电流:1A;触头材质:黄铜;触头镀层:锡;工作温度:-;; LCSC Part Name: 1x6P 间距:1mm 卧贴 系列:SH; Supplier Part: C18077912; Manufacturer: Bossie(博锡); Supplier Footprint: SMD,P=1mm,卧贴; JLCPCB Part Class: 扩展库; Datasheet: https://item.szlcsc.com/datasheet/BX-SH1.0-6PWT/19218313.html; Supplier: LCSC; Pins Structure: 1x6P; Pitch: 1mm; Mounting Type: 卧贴; Reference Series: SH; Number of Pins: 6P; Number of Rows: 1; Number of PINs Per Row: 6; Current Rating: 1A; Contact Material: 黄铜; Contact Plating: 锡; Supplementary Features: 辅助焊脚; Color: 米色; Z-Height of the Board: 3.15mm; X-Length of Bottom Edge on Board (Spacing Line): 8.35mm; Y-Width of Bottom Edge on Board: 5.05mm
U6 = W25Q128JVSIQ_C113767: 接口类型:SPI;存储容量:-;时钟频率(fc):133MHz;; LCSC Part Name: 支持双路/四路SPI接口的3V、128Mbit 串行闪存; Supplier Part: C113767; Manufacturer: Winbond(华邦); Supplier Footprint: SOIC-8-208mil; JLCPCB Part Class: 扩展库; Datasheet: https://item.szlcsc.com/datasheet/W25Q128JVSIQ/115003.html; Supplier: LCSC; Interface: SPI; Clock Frequency: 133MHz; Voltage - Supply: 2.7V~3.6V; Program / Erase Cycles: 100000次; Page Programming Time (Tpp): 3ms
U20 = AT7456E: 视频字符叠加芯片，跟MAX7456-pin-pin; Supplier Part: C82351; Manufacturer: 杭州中科微; Supplier Footprint: TSSOP-28; JLCPCB Part Class: Extended Part; Datasheet: https://atta.szlcsc.com/upload/public/pdf/source/20180326/C82351_A40539A53E8345C88178541014FDE5FB.pdf; Supplier: LCSC
U27 U29 = TPS630701RNMR: 功能类型:升降压型;工作电压:2V~16V;输出电压:5V;输出电流:2A;输出类型:固定;; LCSC Part Name: 2V 至 16V 3.6A 降压-升压转换器; Supplier Part: C2876599; Manufacturer: TI(德州仪器); Supplier Footprint: VQFN-15-HR(2.5x3); JLCPCB Part Class: 扩展库; Datasheet: https://www.ti.com/cn/lit/gpn/tps63070; Supplier: LCSC; Function: 升降压型; Voltage - Supply: 2V~16V; Output Voltage: 5V; Output Current: 2A; Frequency - Switching: 2.4MHz; Operating Temperature: -40℃~+125℃@(TJ); Synchronous Rectifier: 是; Number of Outputs: 1; Topology: 降压-升压式; Quiescent Current: 50uA; Switch tube (built-in/external): 内置; Output Type: 固定
U28 U30 = FTC252012S1R5MBCA: 电感值:1.5uH;精度:±20%;额定电流:3.7A;饱和电流(Isat):4.5A;类型:-;; LCSC Part Name: 1.5uH ±20% 4.5A; Supplier Part: C5832371; Manufacturer: cjiang(长江微电); Supplier Footprint: 1008; JLCPCB Part Class: 扩展库; Datasheet: https://item.szlcsc.com/datasheet/FTC252012S1R5MBCA/6763491.html; Supplier: LCSC; Tolerance: ±20%; Current Rating: 3.7A; Current - Saturation(Isat): 4.5A; DC Resistance(DCR): 44mΩ
X3 = X1E000021015800: 频率:27MHz;晶振类型:贴片无源晶振;负载电容:10pF;等效串联电阻(ESR):40Ω;频率公差:±10ppm;频率稳定度:-;工作温度:-40℃~+85℃;; LCSC Part Name: TSX-3225 27MHz 10pF 10ppm; Supplier Part: C91748; Manufacturer: EPSON(爱普生); Supplier Footprint: SMD3225-4P; JLCPCB Part Class: Extended Part; Datasheet: https://atta.szlcsc.com/upload/public/pdf/source/20170103/1483439947812.pdf; Supplier: LCSC; Operating Temperature: -40℃~+85℃; Crystal Type: 贴片无源晶振; Load Capacitance: 10pF; Equivalent Series Resistance (ESR): 40Ω; Frequency Tolerance: ±10ppm

## Nets
3.3V: C4.1 C5.1 C12.1 C323.2 R1.2 R4.1 R42.1 U7.1(VDDA) U7.3(VDD3P3) U7.4(VDD3P3) U7.11(VDDPST) U7.17(VDDPST) U7.29(VDDD) U7.30(VDDA) U8.11(VBAT_IO) U8.15(VBAT) U10.16(VCC) U26.2(VOUT)
5V-IN: H1.2
+1.1V: C333.1 C334.1 C335.1 C361.2 L1.1 U1.10(DVDD) U1.32(DVDD) U1.51(DVDD) U1.65(VREG_FB)
+3.3V: C324.1 C325.1 C326.1 C327.1 C328.1 C329.1 C330.1 C331.1 C332.1 C337.1 C362.2 C365.2 C366.2 C367.1 R2.2 R38.2 R122.1 R123.1 R124.2 R125.2 R126.2 U1.5(IOVDD) U1.15(IOVDD) U1.24(IOVDD) U1.29(IOVDD) U1.41(IOVDD) U1.50(IOVDD) U1.59(ADC_AVDD) U1.60(IOVDD) U1.64(VREG_VIN) U1.68(USB_OTP_VDD) U1.69(QSPI_IOVDD) U1.76(IOVDD) U2.2(CSB) U2.6(VDDIO) U2.8(VDD) U6.8(VCC) U20.3(DVDD) U20.21(AVDD) U20.24(PVDD)
+3.3V_MCU: C368.1 R33.5(VDDIO) R33.8(VDD)
+5V: C322.2 C350.1 C357.2 C358.2 C359.2 CN17.1 CN19.1 R128.2 U4.1 U5.1 U26.3(VIN) U27.5(FB) U27.7(VOUT) U27.8(VOUT)
+9V: C351.1 C354.2 C355.2 C356.2 R130.2 R133.1 U29.7(VOUT) U29.8(VOUT)
+10V: U3.1
+VBAT: C340.1 C346.1 C352.2 C353.2 R129.2 R131.2 U27.12(VIN) U27.13(VIN) U29.12(VIN) U29.13(VIN)
GND: C2.1 C3.2 C4.2 C5.2 C6.1 C7.1 C8.1 C12.2 C82.1 C322.1 C323.1 C324.2 C325.2 C326.2 C327.2 C328.2 C329.2 C330.2 C331.2 C332.2 C333.2 C334.2 C335.2 C337.2 C338.1 C340.2 C344.1 C346.2 C350.2 C351.2 C352.1 C353.1 C354.1 C355.1 C356.1 C357.1 C358.1 C359.1 C360.2 C361.1 C362.1 C363.2 C364.2 C365.1 C366.1 C367.2 C368.2 CN17.2 CN17.5 CN17.6 CN18.2 CN18.9 CN18.10 CN19.2 CN19.5 CN19.6 FL1.2(GND) FL1.4(GND) H1.1 J1.2 J1.3 LED1.1(C) LED2.1(C) Q1.1(S) Q1.2(S) Q1.3(S) Q2.1(S) Q2.2(S) Q2.3(S) Q3.1(S) Q3.2(S) Q3.3(S) Q4.1(S) Q4.2(S) Q4.3(S) R5.1 R6.2 R33.6(GND) R33.7(RESV) R33.11(RESV) R35.1 R43.2 R115.2 R117.2 R119.2 R121.2 R127.2 R132.2 SW1.1 SW1.2 U1.62(VREG_PGND) U1.81(GND) U2.1(GND) U2.5(SDO) U2.7(GND) U3.2 U3.6 U3.7 U4.2 U4.6 U4.7 U5.2 U5.7 U5.8 U6.4(GND) U7.33(GND) U8.5(GND) U8.13(GND) U8.20(GND) U8.21(GND) U8.23(GND) U8.24(GND) U8.25(GND) U10.1(GND) U10.2(GND) U10.3(GND) U10.7(GND) U10.8(GND) U10.9(GND) U10.11(GND) U10.12(GND) U10.15(GND) U10.17(EP) U20.4(DGND) U20.20(AGND) U20.23(PGND) U20.29(EP) U26.1(VSS) U27.1(PS/SYNC) U27.4(GND) U27.6(FB2) U27.10(PGND) U27.15(VSEL) U29.1(PS/SYNC) U29.4(GND) U29.6(FB2) U29.10(PGND) U29.15(VSEL) X1.2(GND) X1.4(GND) X2.2(GND) X2.4(GND) X3.2(GND) X3.4(GND)
VBAT: C318.2 C319.2 C320.2 C321.2 R34.2
+BATT: CN18.1
ADC_CURR: CN18.3 U1.52(GPIO41_ADC1)
ADC_RSSI: C364.1 U1.53(GPIO42_ADC2)
ADC_VBAT: C363.1 R34.1 R35.2 U1.49(GPIO40_ADC0)
ANT: U7.2(LNA)
BEC_5V_EN: U1.13(GPIO14)
BEC_9V_EN: U1.14(GPIO15)
BEEPER: U1.2(GPIO5)
BOOT: R4.2 SW1.3 SW1.4 U7.15(GPIO0)
BUSY-GPIO5: U7.24(GPIO5) U8.7(BUSY)
DCC_FB: C6.2 C82.2 U8.2(VDD_IN) U8.12(DCC_FB)
DIO1-GPIO4: U7.16(GPIO4) U8.8(DIO1)
GYRO_1_CS: R33.12(AP_CS) U1.78(GPIO1)
GYRO_1_EXTI: R33.4(INT1/INT) U1.22(GPIO22)
I2C0_SCL: U1.45(GPIO36) U2.4(SCK)
I2C0_SDA: U1.44(GPIO35) U2.3(SDI)
I2C_SCL: CN19.4 U5.6
I2C_SDA: CN19.3 U5.5
LED0: R36.2 U1.3(GPIO6)
LED1: R37.2 U1.4(GPIO7)
LED-GPIO16: LED3.2(A) U7.8(XDP_DCDC)
LED_STRIP: U1.47(GPIO38)
M1: R114.2 U1.36(GPIO28)
M2: R116.2 U1.37(GPIO29)
M3: R118.2 U1.38(GPIO30)
M4: R120.2 U1.39(GPIO31)
MISO-GPIO12: U7.10(MTDI) U8.16(MISO_TX)
MOSI-GPIO13: U7.12(MTCK) U8.17(MOSI_RX)
MOTOR_1: CN18.5
MOTOR_2: CN18.6
MOTOR_3: CN18.7
MOTOR_4: CN18.8
NSS-GPIO15: R5.2 U7.13(MTDO) U8.19(NSS_CTS)
OSC-IN: C8.2 U7.28(XTAL_IN) X2.1(OSC1)
OSC-OUT: C7.2 U7.27(XTAL_OUT) X2.3(OSC2)
QSPI_SCLK: U1.71(QSPI_SCLK) U6.6(CLK)
QSPI_SD0: U1.72(QSPI_SD0) U6.5(DI(IO0))
QSPI_SD1: U1.74(QSPI_SD1) U6.2(DO(IO1))
QSPI_SD2: U1.73(QSPI_SD2) U6.3(WP#(IO2))
QSPI_SD3: U1.70(QSPI_SD3) U6.7(HOLD#orRESET#(IO3))
QSPI_SS: R2.1 R3.1 U1.75(QSPI_SS) U6.1(CS#)
Rst_GPIO2: U7.14(GPIO2) U8.3(NRESET)
RX-GPIO3: R8.1 U7.25(U0RXD)
RXEN-GPIO9: U7.18(SD_DATA_2) U10.6(RXEN)
SCK-GPIO14: U7.9(MTMS) U8.18(SCK_RTSN)
SPI0_SCK: R33.13(AP_SCL/AP_SCLK) U1.79(GPIO2)
SPI0_SDI: R33.14(AP_SDA/AP_SDIO/AP_SDI) U1.1(GPIO4)
SPI0_SDO: R33.1(AP_SDO/AP_AD0) U1.80(GPIO3)
SPI1_CS: R122.2 U1.17(GPIO17) U20.8(CS#)
SPI1_MISO: U20.9(SDIN)
SPI1_MOSI: U20.11(SDOUT)
SPI1_SCK: U1.27(GPIO26) U20.10(SCLK)
SPI1_SDI: U1.25(GPIO24)
SPI1_SDO: U1.28(GPIO27)
SWCLK: U1.33(SWCLK)
SWDIO: U1.34(SWDIO)
TELEMETRY: CN18.4
TX-GPIO1: R7.1 U7.26(U0TXD)
TXEN-GPIO10: U7.19(SD_DATA_3) U10.5(TXEN)
UART1_RX: U1.21(GPIO21)
UART1_TX: U1.20(GPIO20)
UART_RX: CN17.3 U3.4 U4.4 U5.3
UART_TX: CN17.4 U3.5 U4.5 U5.4
USB_DM: R40.2
USB_DP: R41.2
VIDEO_IN: C336.2 R127.1 U4.3
VIDEO_OUT: U3.3
VTX: R54.2
$1N4666: LED1.2(A) R36.1
$1N4692: LED2.2(A) R37.1
$1N4850: C360.1 R38.1 U1.61(VREG_AVDD)
$1N6526: L1.2 U1.63(VREG_LX)
$1N6624: R39.1 U1.35(RUN)
$1N6650: R40.1 U1.66(USB_DM)
$1N6676: R41.1 U1.67(USB_DP)
$1N9333: U20.6(XFB) X3.1(OSC1)
$1N9334: U20.5(CLKIN) X3.3(OSC2)
$1N9346: R123.2 U20.12(LOS)
$1N9350: C336.1 U20.22(VIN)
$1N9353: R126.1 U20.19(RESET#)
$1N9354: R124.1 U20.17(VSYNC#)
$1N9355: R125.1 U20.18(HSYNC#)
$1N9359: C314.2 C317.2 R54.1
$1N9360: C317.1 U20.26(VOUT)
$1N9361: C314.1 U20.25(SAG)
$1N17614: C338.2 U27.3(VAUX)
$1N17668: R128.1 U27.2(PG)
$1N17724: R129.1 U27.14(EN)
$1N17780: U27.9(L2) U28.1
$1N17785: U27.11(L1) U28.2
$1N18567: C344.2 U29.3(VAUX)
$1N18571: R130.1 U29.2(PG)
$1N18587: R131.1 U29.14(EN)
$1N18598: U29.9(L2) U30.1
$1N18601: U29.11(L1) U30.2
$1N18821: R132.1 R133.2 U29.5(FB)
$2N2070: C3.1 R1.1 U7.32(EXT_RSTB)
$2N2072: R43.1 U7.31(RES12K)
$2N2074: R42.2 U7.7(CHIP_EN)
$2N2078: U8.4(XTA) X1.3(OUT)
$2N2081: U8.6(XTB) X1.1(IN)
$2N2086: C2.2 U8.1(VR_PA)
$2N2088: J1.1 U10.10(ANT)
$2N2089: FL1.1(IN) U8.22(RFIO)
$2N2102: LED3.1(K) R6.1
$2N2107: H1.4 R8.2
$2N2108: H1.3 R7.2
$2N2118: FL1.3(OUT) U10.4(TXRX)
$3N234: Q1.4(G) R114.1 R115.1
$3N240: C318.1 Q1.5(D) Q1.6(D) Q1.7(D) Q1.8(D) Q1.9(D)
$3N574: Q2.4(G) R116.1 R117.1
$3N578: C319.1 Q2.5(D) Q2.6(D) Q2.7(D) Q2.8(D) Q2.9(D)
$3N765: Q3.4(G) R118.1 R119.1
$3N769: C320.1 Q3.5(D) Q3.6(D) Q3.7(D) Q3.8(D) Q3.9(D)
$3N956: Q4.4(G) R120.1 R121.1
$3N960: C321.1 Q4.5(D) Q4.6(D) Q4.7(D) Q4.8(D) Q4.9(D)

Not connected (* = marked no-connect by the designer): MP1 1; MP2 1; MP3 1; MP4 1; R3 2*; R33 2(RESV)* 3(RESV)* 9(INT2/FSYNC/CLKIN)* 10(RESV)*; R39 2; U1 6(GPIO8) 7(GPIO9) 8(GPIO10) 9(GPIO11) 11(GPIO12) 12(GPIO13) 16(GPIO16) 18(GPIO18) 19(GPIO19) 23(GPIO23) 26(GPIO25) 30(XIN) 31(XOUT) 40(GPIO32) 42(GPIO33) 43(GPIO34) 46(GPIO37) 48(GPIO39) 54(GPIO43_ADC3)* 55(GPIO44_ADC4)* 56(GPIO45_ADC5)* 57(GPIO46_ADC6)* 58(GPIO47_ADC7)* 77(GPIO0); U7 5(VDD_RTC) 6(TOUT) 20(SD_CMD) 21(SD_CLK) 22(SD_DATA_0) 23(SD_DATA_1); U8 9(DIO2)* 10(DIO3)* 14(DCC_SW)*; U10 13(DNC)* 14(VDD)*; U20 1(NC)* 2(NC)* 7(CLKOUT)* 13(NC)* 14(NC)* 15(NC)* 16(NC)* 27(NC)* 28(NC)*

## Notes on the sheets
sheet 2
- 射频模块2.4G
- 时钟信号
- 状态指示灯

# Board PCB1
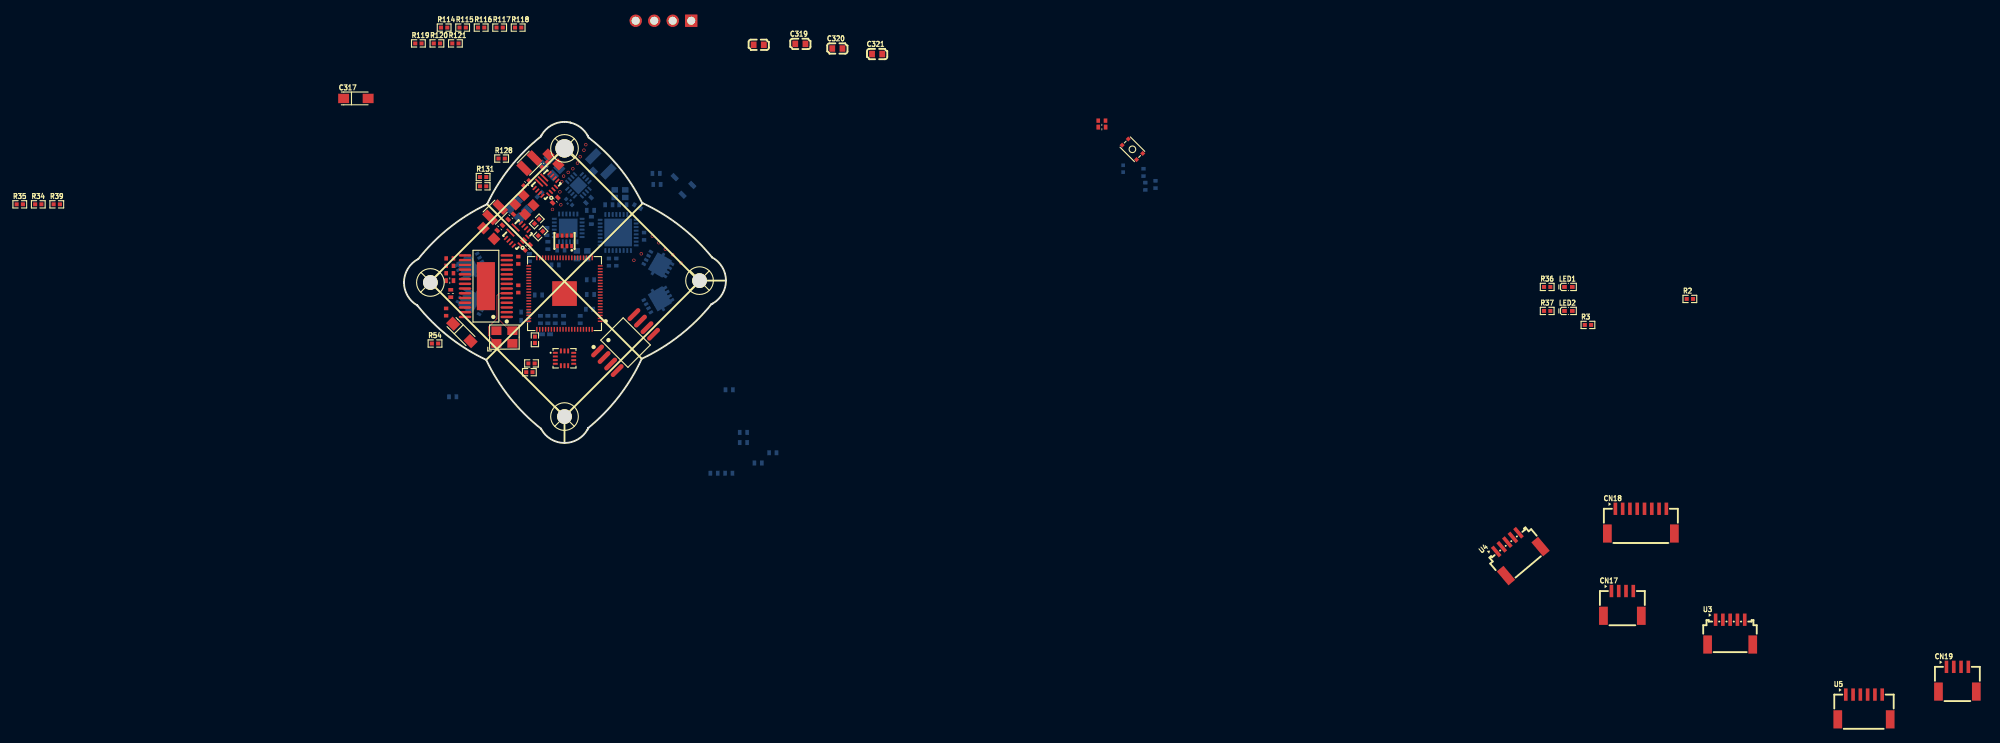
[diagram p3: board, top side]
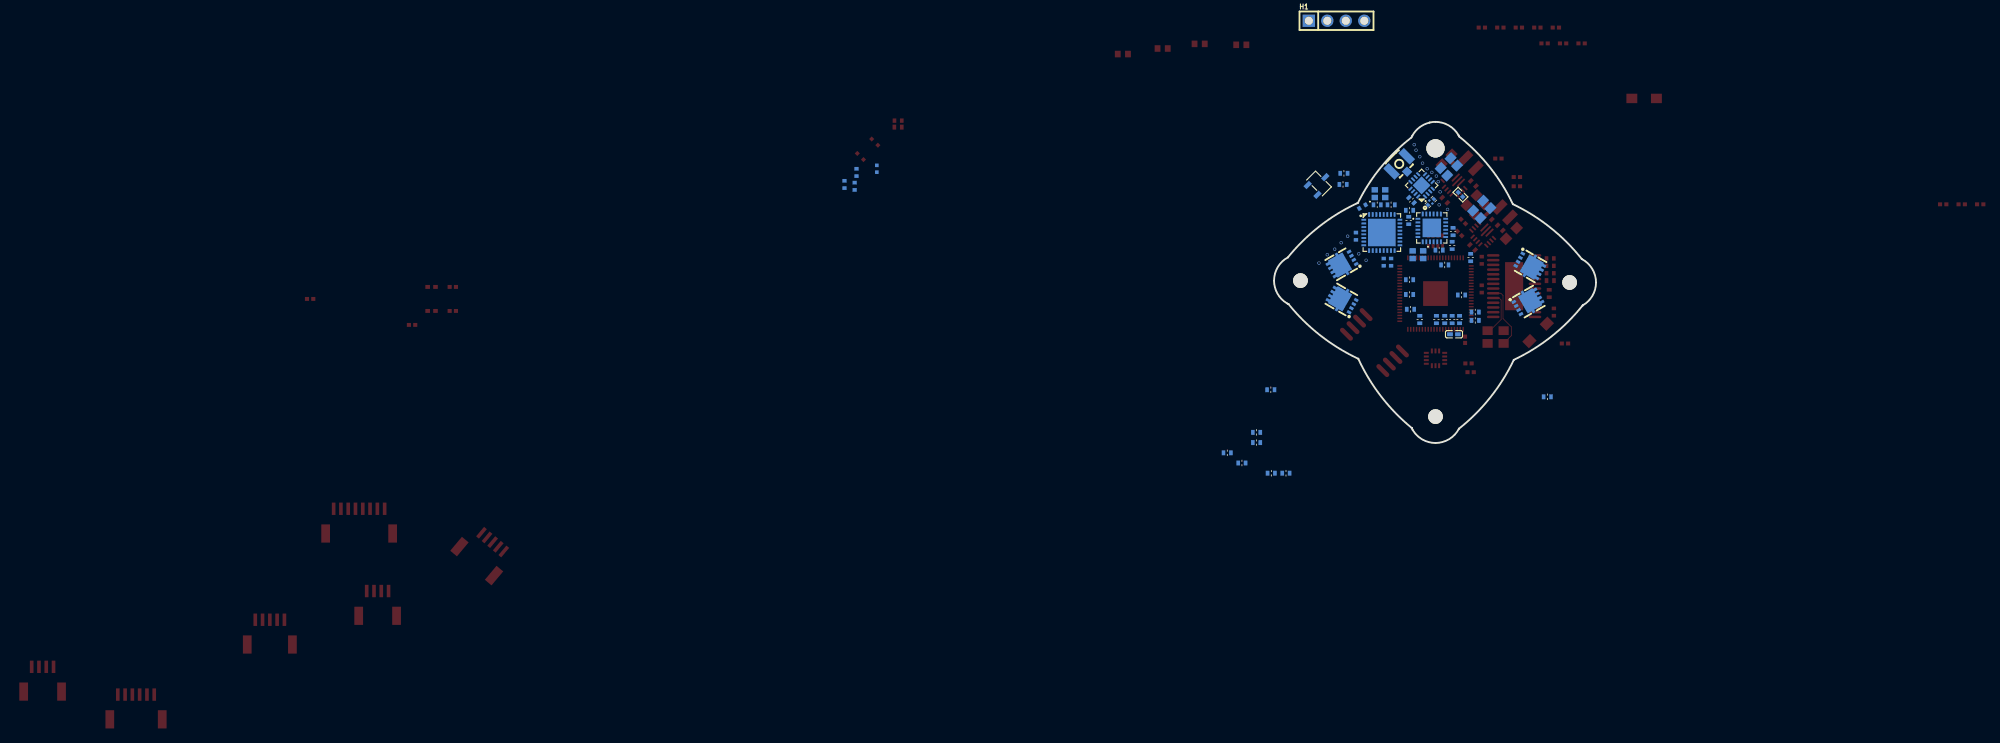
[diagram p4: board, bottom side, seen from below]

Outline 44.21 x 44.1 mm; copper layers: Top Layer, Bottom Layer. Coordinates in mm from the lower left corner of the outline.
Outline path: 0,22.04 arc(0.53,23.92) 1.95,25.26 arc(1.95,25.26) 1.95,25.26 arc(6.25,29.56) 11.4,32.79 arc(11.41,32.8) 11.42,32.81 arc(14.58,37.87) 18.8,42.09 arc(18.81,42.12) 18.81,42.14 arc(18.85,42.21) 18.89,42.27 arc(20.22,43.61) 22.04,44.1 arc(22.44,44.07) 22.83,44.01 arc(22.86,44) 22.88,43.98 arc(24.24,43.34) 25.22,42.2 arc(25.23,42.19) 25.23,42.19 arc(25.29,42.07) 25.35,41.94 arc(29.53,37.87) 32.7,32.96 arc(32.7,32.96) 32.71,32.96 arc(32.76,32.95) 32.81,32.92 arc(37.98,29.74) 42.31,25.49 arc(42.31,25.49) 42.31,25.48 arc(43.7,24.15) 44.21,22.3 arc(43.74,20.51) 42.45,19.19 arc(42.37,19.14) 42.3,19.1 arc(42.27,19.09) 42.24,19.08 arc(42.24,19.08) 42.23,19.08 arc(37.87,14.78) 32.66,11.57 arc(32.65,11.56) 32.64,11.56 arc(29.51,6.39) 25.3,2.06 25.3,2.06 arc(25.3,2.06) 25.3,2.06 arc(25.3,2.03) 25.29,2 arc(25.24,1.91) 25.19,1.82 arc(23.86,0.49) 22.04,0 arc(20.16,0.53) 18.82,1.95 arc(18.82,1.96) 18.82,1.96 arc(14.52,6.25) 11.29,11.4 arc(11.28,11.41) 11.28,11.42 arc(6.13,14.62) 1.84,18.89 arc(1.83,18.89) 1.82,18.9 arc(1.82,18.9) 1.81,18.9 arc(0.49,20.23) 0,22.04
Stack: Top Layer 0.035mm / Dielectric1 1.51mm FR4 er 4.5 / Bottom Layer 0.035mm

## Design rules (mm)
template: 自定义配置
spacing copperThickness1oz (default): track to track 0.102, other pairs 0.152 to 0.3
spacing copperThickness2oz: track to track 0.203, other pairs 0.152 to 0.3
track width copperThickness1oz (default): min 0.102, default 0.102, max 2.54
track width copperThickness2oz: min 0.203, default 0.254, max 2.54
differential pair differentialPair (default): width min 0.127, default 0.254, max 2.54; gap min 0.152, default 0.152
via viaSize (default): diameter min 0.3, default 0.45, max 10; hole min 0.3, default 0.305, max 6.3

## Placement (name value [footprint] x y rotation side)
C2  10nF  [C0402]  25.6 31.95 180 bottom
C3  100nF  [C0402]  95.83 43.38 180 top
C4  100nF  [C0402]  21.53 26.49 180 bottom
C5  100nF  [C0402]  19.63 29.03 270 bottom
C6  470nF  [C0402]  19.76 27.12 270 bottom
C7  10pF  [C0402]  28.14 32.71 0 bottom
C8  10pF  [C0402]  30.04 32.71 180 bottom
C12  100nF  [C0402]  25.34 33.34 45 bottom
C82  10nF  [C0402]  25.72 30.55 270 bottom
C314  47uF  [CAP-SMD_L3.2-W1.6-RD]  7.94 15.18 315 top
C317  47uF  [CAP-SMD_L3.2-W1.6-RD]  -6.61 47.32 0 top
C318  4.7uF  [C0603]  48.71 54.68 0 top
C319  4.7uF  [C0603]  54.43 54.81 0 top
C320  4.7uF  [C0603]  59.51 54.17 0 top
C321  4.7uF  [C0603]  64.97 53.41 0 top
C322  1uF  [C0402]  34.62 37.03 180 bottom
C323  1uF  [C0402]  34.74 35.5 0 bottom
C324  100nF  [C0402]  17.22 25.47 90 bottom
C325  100nF  [C0402]  16.58 17.98 180 bottom
C326  100nF  [C0402]  16.58 16.83 180 bottom
C327  100nF  [C0402]  25.6 22.42 180 bottom
C328  100nF  [C0402]  25.47 18.36 180 bottom
C329  100nF  [C0402]  24.2 16.96 90 bottom
C330  100nF  [C0402]  18.74 16.96 90 bottom
C331  100nF  [C0402]  20.77 16.96 90 bottom
C332  100nF  [C0402]  21.91 16.96 90 bottom
C333  100nF  [C0402]  18.47 20.32 0 bottom
C334  100nF  [C0402]  25.6 20.39 180 bottom
C335  4.7uF  [C0402]  19.76 16.96 90 bottom
C336  100nF  [C0402]  6.42 20.52 270 top
C337  100nF  [C0402]  6.29 22.3 0 top
C338  100nF  [C0402]  20.77 33.34 45 top
C340  10uF  [C0402]  16.84 35.63 225 top
C344  100nF  [C0402]  16.96 26.87 45 top
C346  10uF  [C0402]  13.15 29.53 225 top
C350  10uF  [C0402]  19.38 38.17 45 top
C351  10uF  [C0402]  14.68 31.06 45 top
C352  22uF  [C0805#2]  11.63 28.77 315 top
C353  22uF  [C0805]  17.09 33.34 315 top
C354  22uF  [C0805]  15.18 31.57 315 bottom
C355  22uF  [C0805]  16.2 32.58 315 bottom
C356  22uF  [C0805]  15.95 32.07 315 top
C357  22uF  [C0805]  20.52 38.93 315 top
C358  22uF  [C0805]  19.76 37.41 315 bottom
C359  22uF  [C0805]  20.65 38.42 315 bottom
C360  4.7uF  [C0402]  44.65 7.31 180 bottom
C361  4.7uF  [C0402]  20.77 24.45 0 bottom
C362  4.7uF  [C0402]  6.68 6.34 180 bottom
C363  100nF  [C0402]  42.57 -4.15 180 bottom
C364  100nF  [C0402]  44.59 -4.15 180 bottom
C365  100nF  [C0402]  46.6 1.46 180 bottom
C366  100nF  [C0402]  46.6 0.06 180 bottom
C367  100nF  [C0402]  50.63 -1.35 180 bottom
C368  100nF  [C0402]  48.62 -2.75 180 bottom
CN17  BX-SH1.0-4PWT  [CONN-SMD_4P-P1.00_BX-SH1.0-4PWT]  167.3 -22.03 0 top
CN18  BX-SH1.0-8PWT  [CONN-SMD_8P-P1.00_BX-SH1.0-8PWT]  169.84 -10.73 0 top
CN19  BX-SH1.0-4PWT  [CONN-SMD_4P-P1.00_BX-SH1.0-4PWT]  213.3 -32.44 0 top
FL1  2450FM07D0034T  [FILTER-SMD_4P-L1.0-W0.5-L]  22.68 33.09 135 bottom
H1  PZ254V-11-04P  [HDR-TH_4P-P2.54-V-M]  35.63 57.98 180 bottom
J1  BWU.FL-IPEX1  [IPEX-SMD_BWIPX-1-001E]  26.49 37.79 45 bottom
L1  3.3uH  [L0402]  19.5 14.93 180 bottom
LED1  -  [LED_0402]  159.89 21.43 0 top
LED2  -  [LED_0402]  159.89 18.13 0 top
LED3  XL-1005UGC  [0402#2]  98.75 37.66 90 bottom
MP1  -  [M2螺丝#2]  22.04 3.63 0 top
MP2  -  [M2螺丝]  22.04 40.46 0 top
MP3  -  [M2螺丝#2]  3.63 22.04 0 top
MP4  -  [M2螺丝#2]  40.58 22.3 0 top
Q1  TPN2R703NL,L1Q(M  [TSON-8_L3.1-W3.1-P0.65-LS3.3-BL-EP]  9.09 24.33 300 bottom
Q2  TPN2R703NL,L1Q(M  [TSON-8_L3.1-W3.1-P0.65-LS3.3-BL-EP]  9.34 19.38 240 bottom
Q3  TPN2R703NL,L1Q(M  [TSON-8_L3.1-W3.1-P0.65-LS3.3-BL-EP]  34.87 24.58 60 bottom
Q4  TPN2R703NL,L1Q(M  [TSON-8_L3.1-W3.1-P0.65-LS3.3-BL-EP]  34.87 19.63 120 bottom
R1  12kΩ  [0402]  95.83 44.27 180 top
R2  10K  [R0402]  176.57 19.78 0 top
R3  1K  [R0402]  162.57 16.21 0 top
R4  12kΩ  [0402]  28.14 24.84 90 bottom
R5  12kΩ  [0402]  29.15 24.84 90 bottom
R6  12kΩ  [0402]  101.54 37.15 90 bottom
R7  100Ω  [0402]  101.8 35.25 270 bottom
R8  100Ω  [0402]  103.19 35.5 270 bottom
R33  ICM-42688-P  [LGA-14_L3.0-W2.5-P0.50-TL]  22.04 11.63 0 top
R34  10K  [R0402]  -50.22 32.77 0 top
R35  1K  [R0402]  -52.76 32.77 0 top
R36  330R  [R0402]  156.98 21.43 0 top
R37  330R  [R0402]  156.98 18.13 0 top
R38  33R  [R0402]  17.98 14.17 270 top
R39  1K  [R0402]  -47.67 32.77 0 top
R40  33R  [R0402]  17.51 10.93 0 top
R41  33R  [R0402]  17.22 9.72 0 top
R42  12kΩ  [0402]  32.96 28.39 270 bottom
R43  12kΩ  [0402]  32.07 32.46 330 bottom
R54  75Ω  [R0402]  4.26 13.66 0 top
R114  330R  [R0402]  5.51 57.05 0 top
R115  10K  [R0402]  8.06 57.05 0 top
R116  330R  [R0402]  10.6 57.05 0 top
R117  10K  [R0402]  13.14 57.05 0 top
R118  330R  [R0402]  15.68 57.05 0 top
R119  10K  [R0402]  1.98 54.87 0 top
R120  330R  [R0402]  4.52 54.87 0 top
R121  10K  [R0402]  7.06 54.87 0 top
R122  10K  [0402]  15.69 21.15 90 top
R123  1K  [0402]  15.69 25.09 270 top
R124  1K  [0402]  6.29 25.34 180 top
R125  1K  [0402]  6.29 24.33 180 top
R126  10K  [0402]  6.29 23.31 180 top
R127  75R  [0402]  5.79 17.98 90 top
R128  100K  [R0402]  13.41 39.06 0 top
R129  10K  [R0402]  18.61 34.11 225 bottom
R130  100K  [R0402]  10.87 35.25 180 top
R131  10K  [R0402]  10.87 36.52 0 top
R132  39K  [R0402]  18.23 30.42 45 top
R133  402K  [R0402]  18.74 28.77 45 top
SW1  TS-1928-B  [KEY-SMD_4P-L2.8-W2.0-P1.20-LS3.0-TL]  100.02 40.33 315 top
U1  RP2350B  [QFN-80_L10.0-W10.0-P0.40-TL-EP3.4]  22.04 20.52 180 top
U2  BMP280  [LGA-8_L2.5-W2.0-P0.65_AMP6127]  22.04 27.76 270 top
U3  BX-SH1.0-5PWT  [CONN-SMD_5P-P1.00_BX-SH1.0-5PWT]  182.1 -25.97 0 top
U4  BX-SH1.0-5PWT  [CONN-SMD_5P-P1.00_BX-SH1.0-5PWT]  152.6 -14.92 40 top
U5  BX-SH1.0-6PWT  [CONN-SMD_6P-P1.00_BX-SH1.0-6PWT]  200.48 -36.25 0 top
U6  W25Q128JVSIQ  [SOIC-8_L5.3-W5.3-P1.27-LS8.0-BL]  30.42 13.79 315 top
U7  ESP8285H16  [QFN-32_L5.0-W5.0-P0.50-TL-EP3.7]  29.41 28.9 180 bottom
U8  SX1280IMLTRT  [QFN-24_L4.0-W4.0-P0.50-BL-EP2.6]  22.55 29.53 270 bottom
U10  AT2401C  [QFN-16_L3.0-W3.0-P0.50-BL-EP1.7]  23.95 35.38 135 bottom
U20  AT7456E  [TSSOP-28_L9.7-W4.4-P0.65-LS6.4-BL-EP-2]  11.25 21.53 90 top
U26  ME6211A33M3G-N  [SOT-23-3_L2.9-W1.6-P1.90-LS2.8-BR]  38.04 35.63 315 bottom
U27  TPS630701RNMR  [VQFN-HR-15_L3.0-W2.5-P0.50-BL_TPS63070RNMR]  19.63 35.38 45 top
U28  1.5uH  [IND-SMD_L2.5-W2.0_MEKK2520TR47M]  17.22 38.42 45 top
U29  TPS630701RNMR  [VQFN-HR-15_L3.0-W2.5-P0.50-BL_TPS63070RNMR]  15.69 28.52 45 top
U30  1.5uH  [IND-SMD_L2.5-W2.0_MEKK2520TR47M]  12.52 31.69 45 top
X1  52MHz  [CRYSTAL-SMD_4P-L2.0-W1.6-BL]  24.46 25.85 0 bottom
X2  26MHz  [CRYSTAL-SMD_4P-L2.0-W1.6-BL]  29.66 34.23 180 bottom
X3  27MHz  [OSC-SMD_4P-L3.2-W2.5-BL]  13.79 14.55 0 top

## Footprints (pads in the part's own frame, mm; a bottom-side part is the same pattern mirrored in y, then rotated)
0402
  rect 0.5x0.6 smd: 1(-0.5,0) 2(0.5,0)
0402#2
  rect 0.5x0.5 smd: 1(-0.47,0) 2(0.47,0)
C0402
  rect 0.5x0.68 smd: 1(-0.516,0) 2(0.5,0)
C0603
  rect 0.8x0.9 smd: 1(-0.7,0) 2(0.7,0)
C0805
  rect 1.3x1.1 smd: 1(-0.962,0) 2(0.962,0)
C0805#2
  rect 1.3x1.2 smd: 1(-1.038,0) 2(1.038,0)
CAP-SMD_L3.2-W1.6-RD
  rect 1.5x1.296 smd: 1(-1.687,0) 2(1.687,0)
CONN-SMD_4P-P1.00_BX-SH1.0-4PWT
  rect 0.5x1.7 smd: 1(-1.5,1.7) 2(-0.5,1.7) 3(0.5,1.7) 4(1.5,1.7)
  rect 1.2x2.5 smd: 5(2.6,-1.7) 6(-2.6,-1.7)
CONN-SMD_5P-P1.00_BX-SH1.0-5PWT
  rect 0.5x1.7 smd: 1(-2,1.7) 2(-1,1.7) 3(0,1.7) 4(1,1.7) 5(2,1.7)
  rect 1.2x2.5 smd: 6(3.1,-1.7) 7(-3.1,-1.7)
CONN-SMD_6P-P1.00_BX-SH1.0-6PWT
  rect 0.5x1.7 smd: 1(-2.5,1.7) 2(-1.5,1.7) 3(-0.5,1.7) 4(0.5,1.7) 5(1.5,1.7) 6(2.5,1.7)
  rect 1.2x2.5 smd: 7(3.6,-1.7) 8(-3.6,-1.7)
CONN-SMD_8P-P1.00_BX-SH1.0-8PWT
  rect 0.5x1.7 smd: 1(-3.5,1.7) 2(-2.5,1.7) 3(-1.5,1.7) 4(-0.5,1.7) 5(0.5,1.7) 6(1.5,1.7) 7(2.5,1.7) 8(3.5,1.7)
  rect 1.2x2.5 smd: 9(4.6,-1.7) 10(-4.6,-1.7)
CRYSTAL-SMD_4P-L2.0-W1.6-BL
  rect 0.889x0.762 smd: 1(-0.722,-0.523) 2(0.722,-0.523) 3(0.722,0.523) 4(-0.722,0.523)
FILTER-SMD_4P-L1.0-W0.5-L
  rect 0.45x0.5 smd: 1(-0.575,0) 3(0.575,0)
  rect 0.3x0.3 smd: 2(0,-0.3) 4(0,0.3)
HDR-TH_4P-P2.54-V-M
  rect 1.7x1.7 hole 1.1: 1(-3.81,0)
  round 1.7 hole 1.1: 2(-1.27,0) 3(1.27,0) 4(3.81,0)
IND-SMD_L2.5-W2.0_MEKK2520TR47M
  rect 1x2.1 smd: 1(1,0) 2(-1,0)
IPEX-SMD_BWIPX-1-001E
  rect 1.05x1 smd: 1(-0.762,0)
  rect 2.2x1.05 smd: 2(0.762,-1.475) 3(0.762,1.475)
KEY-SMD_4P-L2.8-W2.0-P1.20-LS3.0-TL
  rect 0.5x0.5 smd: 1(-1.4,0.6) 2(1.4,0.6) 3(-1.4,-0.6) 4(1.4,-0.6)
L0402
  rect 0.79x0.54 smd: 1(-0.545,0) 2(0.545,0)
LED_0402
  rect 0.637x0.541 smd: 1(-0.538,0) 2(0.538,0)
LGA-8_L2.5-W2.0-P0.65_AMP6127
  rect 0.6x0.4 smd: 1(0.725,0.975) 2(0.725,0.325) 3(0.725,-0.325) 4(0.725,-0.975) 5(-0.725,-0.975) 6(-0.725,-0.325) 7(-0.725,0.325) 8(-0.725,0.975)
LGA-14_L3.0-W2.5-P0.50-TL
  rect 0.675x0.28 smd: 1(-1.262,0.75) 2(-1.262,0.25) 3(-1.262,-0.25) 4(-1.262,-0.75) 8(1.262,-0.75) 9(1.262,-0.25) 10(1.262,0.25) 11(1.262,0.75)
  rect 0.28x0.675 smd: 5(-0.5,-1.012) 6(0,-1.012) 7(0.5,-1.012) 12(0.5,1.012) 13(0,1.012) 14(-0.5,1.012)
M2螺丝
  round 2.5 hole 2.5: 1(0,0)
M2螺丝#2
  round 2 hole 2: 1(0,0)
OSC-SMD_4P-L3.2-W2.5-BL
  rect 1.4x1.2 smd: 1(-1.1,-0.875) 2(1.1,-0.875) 3(1.1,0.875) 4(-1.1,0.875)
QFN-16_L3.0-W3.0-P0.50-BL-EP1.7
  rect 0.28x0.665 smd: 1(-0.75,-1.407) 2(-0.25,-1.407) 3(0.25,-1.407) 4(0.75,-1.407) 9(0.75,1.407) 10(0.25,1.407) 11(-0.25,1.407) 12(-0.75,1.407)
  rect 0.665x0.28 smd: 5(1.407,-0.75) 6(1.407,-0.25) 7(1.407,0.25) 8(1.407,0.75) 13(-1.407,0.75) 14(-1.407,0.25) 15(-1.407,-0.25) 16(-1.407,-0.75)
  rect 1.75x1.75 smd: 17(0,0)
QFN-24_L4.0-W4.0-P0.50-BL-EP2.6
  rect 0.28x0.665 smd: 1(-1.25,-1.907) 2(-0.75,-1.907) 3(-0.25,-1.907) 4(0.25,-1.907) 5(0.75,-1.907) 6(1.25,-1.907) 13(1.25,1.907) 14(0.75,1.907) 15(0.25,1.907) 16(-0.25,1.907) 17(-0.75,1.907) 18(-1.25,1.907)
  rect 0.665x0.28 smd: 7(1.907,-1.25) 8(1.907,-0.75) 9(1.907,-0.25) 10(1.907,0.25) 11(1.907,0.75) 12(1.907,1.25) 19(-1.907,1.25) 20(-1.907,0.75) 21(-1.907,0.25) 22(-1.907,-0.25) 23(-1.907,-0.75) 24(-1.907,-1.25)
  rect 2.55x2.55 smd: 25(0,0)
QFN-32_L5.0-W5.0-P0.50-TL-EP3.7
  rect 0.65x0.28 smd: 1(-2.478,1.75) 2(-2.478,1.25) 3(-2.478,0.75) 4(-2.478,0.25) 5(-2.478,-0.25) 6(-2.478,-0.75) 7(-2.478,-1.25) 8(-2.478,-1.75) 17(2.478,-1.75) 18(2.478,-1.25) 19(2.478,-0.75) 20(2.478,-0.25) 21(2.478,0.25) 22(2.478,0.75) 23(2.478,1.25) 24(2.478,1.75)
  rect 0.28x0.65 smd: 9(-1.75,-2.478) 10(-1.25,-2.478) 11(-0.75,-2.478) 12(-0.25,-2.478) 13(0.25,-2.478) 14(0.75,-2.478) 15(1.25,-2.478) 16(1.75,-2.478) 25(1.75,2.478) 26(1.25,2.478) 27(0.75,2.478) 28(0.25,2.478) 29(-0.25,2.478) 30(-0.75,2.478) 31(-1.25,2.478) 32(-1.75,2.478)
  rect 3.8x3.8 smd: 33(0,0)
QFN-80_L10.0-W10.0-P0.40-TL-EP3.4
  rect 0.665x0.2 smd: 1(-4.907,3.8) 2(-4.907,3.4) 3(-4.907,3) 4(-4.907,2.6) 5(-4.907,2.2) 6(-4.907,1.8) 7(-4.907,1.4) 8(-4.907,1) 9(-4.907,0.6) 10(-4.907,0.2) 11(-4.907,-0.2) 12(-4.907,-0.6) 13(-4.907,-1) 14(-4.907,-1.4) 15(-4.907,-1.8) 16(-4.907,-2.2) 17(-4.907,-2.6) 18(-4.907,-3) 19(-4.907,-3.4) 20(-4.907,-3.8) 41(4.907,-3.8) 42(4.907,-3.4) 43(4.907,-3) 44(4.907,-2.6) 45(4.907,-2.2) 46(4.907,-1.8) 47(4.907,-1.4) 48(4.907,-1) 49(4.907,-0.6) 50(4.907,-0.2) 51(4.907,0.2) 52(4.907,0.6) 53(4.907,1) 54(4.907,1.4) 55(4.907,1.8) 56(4.907,2.2) 57(4.907,2.6) 58(4.907,3) 59(4.907,3.4) 60(4.907,3.8)
  rect 0.2x0.665 smd: 21(-3.8,-4.907) 22(-3.4,-4.907) 23(-3,-4.907) 24(-2.6,-4.907) 25(-2.2,-4.907) 26(-1.8,-4.907) 27(-1.4,-4.907) 28(-1,-4.907) 29(-0.6,-4.907) 30(-0.2,-4.907) 31(0.2,-4.907) 32(0.6,-4.907) 33(1,-4.907) 34(1.4,-4.907) 35(1.8,-4.907) 36(2.2,-4.907) 37(2.6,-4.907) 38(3,-4.907) 39(3.4,-4.907) 40(3.8,-4.907) 61(3.8,4.907) 62(3.4,4.907) 63(3,4.907) 64(2.6,4.907) 65(2.2,4.907) 66(1.8,4.907) 67(1.4,4.907) 68(1,4.907) 69(0.6,4.907) 70(0.2,4.907) 71(-0.2,4.907) 72(-0.6,4.907) 73(-1,4.907) 74(-1.4,4.907) 75(-1.8,4.907) 76(-2.2,4.907) 77(-2.6,4.907) 78(-3,4.907) 79(-3.4,4.907) 80(-3.8,4.907)
  rect 3.4x3.4 smd: 81(0,0)
R0402
  rect 0.566x0.54 smd: 1(-0.433,0) 2(0.433,0)
SOIC-8_L5.3-W5.3-P1.27-LS8.0-BL
  oval 0.63x2.25 smd: 1(-1.905,-3.53) 2(-0.635,-3.53) 3(0.635,-3.53) 4(1.905,-3.53) 5(1.905,3.53) 6(0.635,3.53) 7(-0.635,3.53) 8(-1.905,3.53)
SOT-23-3_L2.9-W1.6-P1.90-LS2.8-BR
  rect 1.07x0.6 smd: 1(1.235,-0.95) 2(1.235,0.95) 3(-1.235,0)
TSON-8_L3.1-W3.1-P0.65-LS3.3-BL-EP
  rect 0.4x0.6 smd: 1(-0.975,-1.675) 2(-0.325,-1.675) 3(0.325,-1.675) 4(0.975,-1.675) 5(0.975,1.675) 6(0.325,1.675) 7(-0.325,1.675) 8(-0.975,1.675)
  rect 0.6x0.4 smd: 9(-1.42,0) 9(1.42,0)
  rect 2.7x2.3 smd: 9(0.02,0.325)
TSSOP-28_L9.7-W4.4-P0.65-LS6.4-BL-EP-2
  oval 0.343x1.732 smd: 1(-4.225,-2.866) 2(-3.575,-2.866) 3(-2.925,-2.866) 4(-2.275,-2.866) 5(-1.625,-2.866) 6(-0.975,-2.866) 7(-0.325,-2.866) 8(0.325,-2.866) 9(0.975,-2.866) 10(1.625,-2.866) 11(2.275,-2.866) 12(2.925,-2.866) 13(3.575,-2.866) 14(4.225,-2.866) 15(4.225,2.866) 16(3.575,2.866) 17(2.925,2.866) 18(2.275,2.866) 19(1.625,2.866) 20(0.975,2.866) 21(0.325,2.866) 22(-0.325,2.866) 23(-0.975,2.866) 24(-1.625,2.866) 25(-2.275,2.866) 26(-2.925,2.866) 27(-3.575,2.866) 28(-4.225,2.866)
  rect 6.604x2.489 smd: 29(0,0)
VQFN-HR-15_L3.0-W2.5-P0.50-BL_TPS63070RNMR
  rect 0.25x0.7 smd: 1(-0.75,-1.016) 2(-0.25,-1.016) 3(0.25,-1.016) 4(0.75,-1.016)
  rect 0.7x0.25 smd: 5(1.45,-0.566) 6(1.45,-0.066) 7(1.45,0.434) 8(1.45,0.934) 12(-1.45,0.934) 13(-1.45,0.434) 14(-1.45,-0.066) 15(-1.45,-0.566)
  rect 0.25x1.45 smd: 9(0.5,1.016) 11(-0.5,1.016)
  rect 0.25x1.85 smd: 10(0,0.817)

## Nets
As in the schematic, except:
RST_GPIO2: U7.14 U8.3

Pads without a net: MP1 1; MP2 1; MP3 1; MP4 1; R3 2; R33 2 3 9 10; R39 2; U1 6 7 8 9 11 12 16 18 19 23 26 30 31 40 42 43 46 48 54 55 56 57 58 77; U7 5 6 20 21 22 23; U8 9 10 14; U10 13 14; U20 1 2 7 13 14 15 16 27 28

## Via types
v1: diameter 0.45, hole 0.305, Top Layer to Bottom Layer, 18 vias

## Routing (per net, layer and track width the routed paths; a pad name or vN(x,y) marks a point on that pad's centre or on a via; arc(x,y) is an arc through that point)
(no net):
  vias: v1(20.39,32.07) v1(21.41,34.49) v1(21.53,32.71) v1(21.66,35.88) v1(21.91,36.65) v1(22.55,37.15) v1(23.19,37.66) v1(23.82,38.42) v1(24.2,39.31) v1(24.71,40.2) v1(24.96,40.96) v1(31.57,25.09) v1(32.58,25.98) v1(34.11,28.39) v1(35,27.5) v1(35.88,26.61) v1(36.9,25.85) v1(38.04,24.71)
$1N9333: length 9
  Top Layer w0.102: X3.1 11.63,14.73 11.63,15.95 12.77,17.09 12.77,20.26 13.07,20.56 U20.6
$1N9334: length 6.4
  Top Layer w0.102: X3.3 14.56,15.42 13.03,16.96 13.03,19.63 13.31,19.91 U20.5
